# EAGLE design Reaccion-v0.9 (EAGLE 7.4.0)
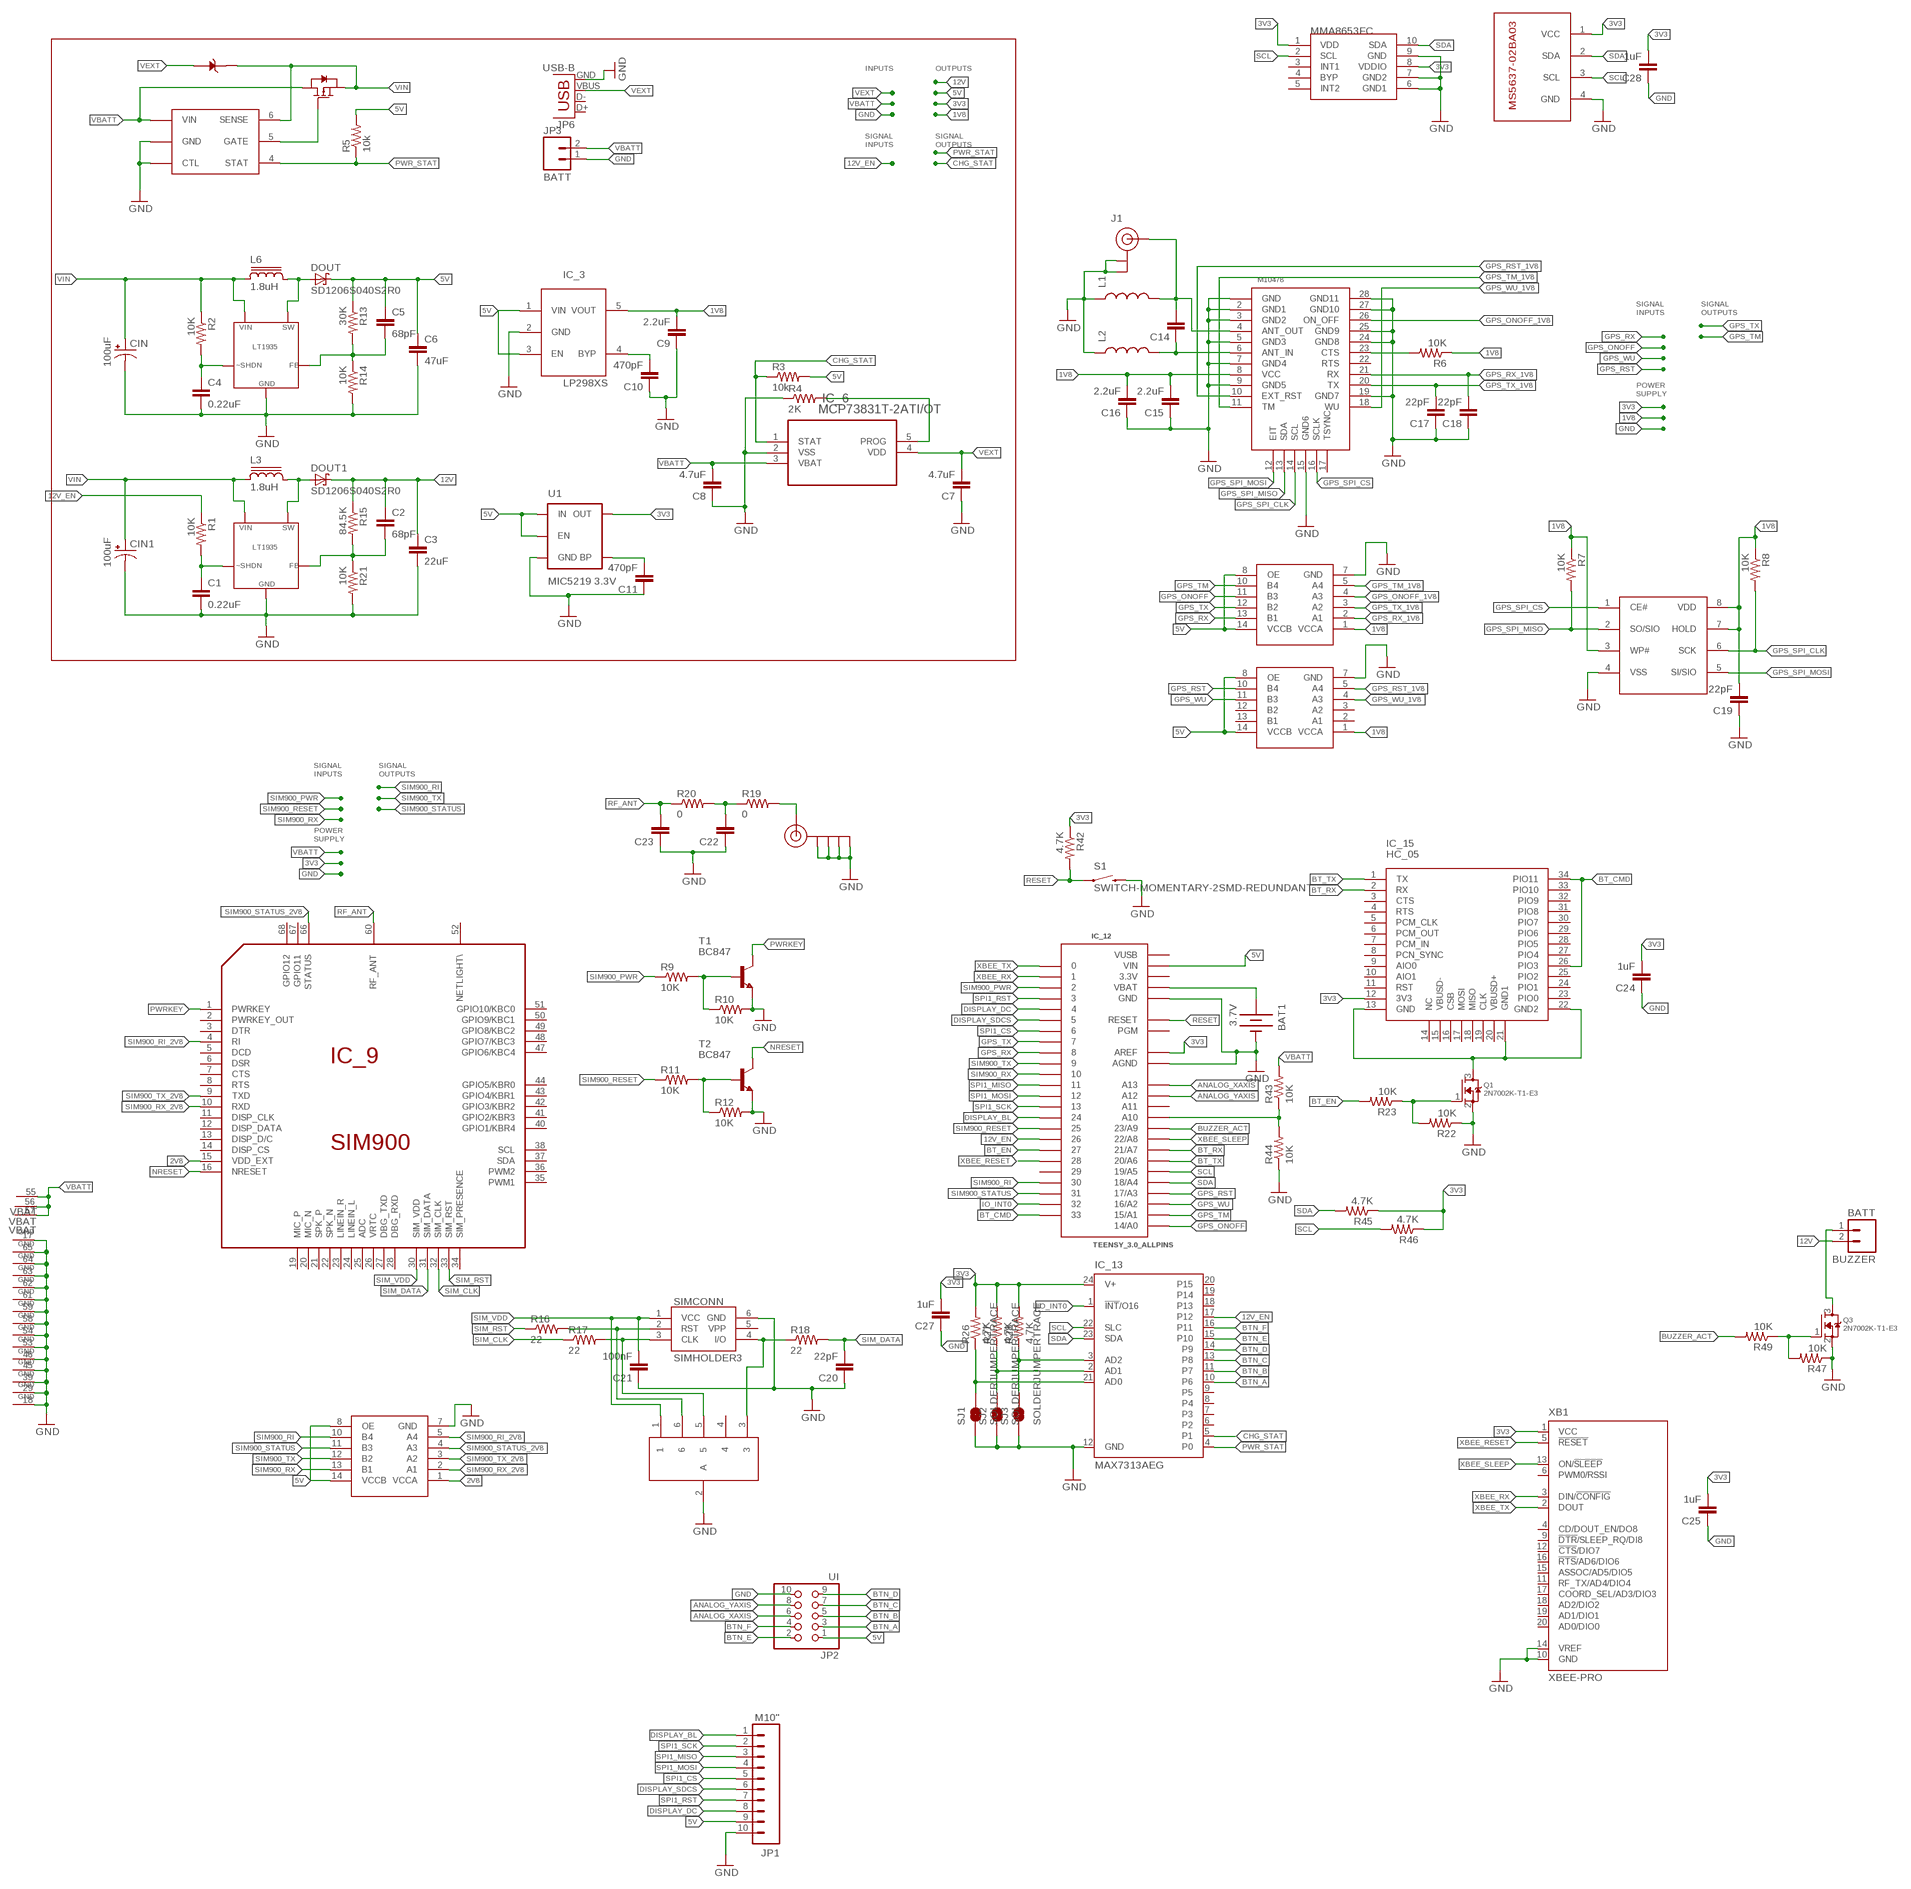
[diagram p0: schematic, sheet 1]

## Parts
BAT1  3.7V  BATTERY12MM  [BATTCON_12MM]
BUZZER  BATT  M02-JST-2-PTH-NO_SILK  [JST-2-PTH-NS]
C1  0.22uF  CAP0805  [0805]
C2  68pF  CAP0805  [0805]
C3  22uF  CAP0805  [0805]
C4  0.22uF  CAP0805  [0805]
C5  68pF  CAP0805  [0805]
C6  47uF  CAP0805  [0805]
C7  4.7uF  CAP0805  [0805]
C8  4.7uF  CAP0805  [0805]
C9  2.2uF  CAP0805  [0805]
C10  470pF  CAP0805  [0805]
C11  470pF  CAP0805  [0805]
C14  CAP0805  [0805]
C15  2.2uF  CAP0805  [0805]
C16  2.2uF  CAP0805  [0805]
C17  22pF  CAP0805  [0805]
C18  22pF  CAP0805  [0805]
C19  22pF  CAP0805  [0805]
C20  22pF  CAP0805  [0805]
C21  100nF  CAP0805  [0805]
C22  CAP0805  [0805]
C23  CAP0805  [0805]
C24  1uF  CAP0805  [0805]
C25  1uF  CAP0805  [0805]
C27  1uF  CAP0805  [0805]
C28  1uF  CAP0805  [0805]
CIN  100uF  TPSB107M010R0400  [1210-POLARIZED]
CIN1  100uF  TPSB107M010R0400  [1210-POLARIZED]
D4  1N5819HW-7-F  [SOD123]
DOUT  SD1206S040S2R0  [1206-POL]
DOUT1  SD1206S040S2R0  [1206-POL]
IC_1  LTC4412  [SOT23-6L]
IC_3  LP298XS  [SOT23-5L]
IC_6  MCP73831T-2ATI/OT  [SOT95P300X145-5N]
IC_7  MMA8653FC  [2X2-DFN]
IC_8  MS5637-02BA03  [MS5637-02BA03]
IC_9  SIM900  [SIM900]
IC_10  TXB0104  [SO14]
IC_11  SMF05C  [SOT665]
IC_12  TEENSY_3.0_ALLPINS  [TEENSY_3.0_ALLPINS]
IC_13  MAX7313AEG  [QSOP24]
IC_15  HC_05  [BLUETOOTH_SMD]
IC_16  M10478  [M10478]
IC_17  TXB0104  [SO14]
IC_18  TXB0104  [SO14]
IC_19  SST25WF040B  [SO08]
J1  U.FL  [U.FL]
J$1  SMA_EDGE  [SMA-EDGE]
JP1  M10"  [1X10]
JP2  UI  PINHD-2X5  [2X05]
JP3  BATT  M02-JST-2-PTH-NO_SILK  [JST-2-PTH-NS]
JP6  USB-B  USBPTH  [USB-B-PTH]
L1  INDUCTOR0805  [0805]
L2  INDUCTOR0805  [0805]
L3  1.8uH  SRR4028  [SRR4028]
L6  1.8uH  SRR4028  [SRR4028]
Q1  2N7002K-T1-E3  MOSFET-NREFLOW  [SOT23]
Q3  2N7002K-T1-E3  MOSFET-NREFLOW  [SOT23]
Q9  SI2301CDS  [SOT23]
R1  10K  RESISTOR0805-RES  [0805]
R2  10K  RESISTOR0805-RES  [0805]
R3  10k  RESISTOR0805-RES  [0805]
R4  2K  RESISTOR0805-RES  [0805]
R5  10k  RESISTOR0805-RES  [0805]
R6  10K  RESISTOR0805-RES  [0805]
R7  10K  RESISTOR0805-RES  [0805]
R8  10K  RESISTOR0805-RES  [0805]
R9  10K  RESISTOR0805-RES  [0805]
R10  10K  RESISTOR0805-RES  [0805]
R11  10K  RESISTOR0805-RES  [0805]
R12  10K  RESISTOR0805-RES  [0805]
R13  30K  RESISTOR0805-RES  [0805]
R14  10K  RESISTOR0805-RES  [0805]
R15  84.5K  RESISTOR0805-RES  [0805]
R16  22  RESISTOR0805-RES  [0805]
R17  22  RESISTOR0805-RES  [0805]
R18  22  RESISTOR0805-RES  [0805]
R19  0  RESISTOR0805-RES  [0805]
R20  0  RESISTOR0805-RES  [0805]
R21  10K  RESISTOR0805-RES  [0805]
R22  10K  RESISTOR0805-RES  [0805]
R23  10K  RESISTOR0805-RES  [0805]
R26  4.7K  RESISTOR0805-RES  [0805]
R27  4.7K  RESISTOR0805-RES  [0805]
R28  4.7K  RESISTOR0805-RES  [0805]
R42  4.7K  RESISTOR0805-RES  [0805]
R43  10K  RESISTOR0805-RES  [0805]
R44  10K  RESISTOR0805-RES  [0805]
R45  4.7K  RESISTOR0805-RES  [0805]
R46  4.7K  RESISTOR0805-RES  [0805]
R47  10K  RESISTOR0805-RES  [0805]
R49  10K  RESISTOR0805-RES  [0805]
S1  SWITCH-MOMENTARY-2SMD-REDUNDANT  [TACTILE-SWITCH-SMD]
SIMCONN  SIMHOLDER3  [SIMHOLDER3]
SJ1  SOLDERJUMPERTRACE  [SJ_2S-TRACE]
SJ2  SOLDERJUMPERTRACE  [SJ_2S-TRACE]
SJ3  SOLDERJUMPERTRACE  [SJ_2S-TRACE]
T1  BC847  [SOT23]
T2  BC847  [SOT23]
U1  MIC5219 3.3V  V_REG_MIC52193.3V  [SOT23-5]
U$1  LT1935ES5  [SOT23-5]
U$2  LT1935ES5  [SOT23-5]
XB1  XBEE-PRO  [XBEE-PRO]

## Nets
1V8: C9.2 C15.2 C16.2 C19.2 IC_3.5(VOUT) IC_16.8(VCC) IC_17.1(VCCA) IC_18.1(VCCA) IC_19.3(WP#) IC_19.7(HOLD) IC_19.8(VDD) R6.1 R7.1 R8.1
2V8: IC_9.15(VDD_EXT) IC_10.1(VCCA)
3V3: C24.2 C25.2 C27.2 C28.2 IC_7.1(VDD) IC_7.8(VDDIO) IC_8.1(VCC) IC_12.AREF IC_13.24(V+) IC_15.12(3V3) R26.2 R27.2 R28.2 R42.1 R45.1 R46.1 U1.5(OUT) XB1.1(VCC)
5V: C5.1 C6.1 DOUT.2(C) IC_3.1(VIN) IC_3.3(EN) IC_10.8(OE) IC_10.14(VCCB) IC_12.VIN IC_17.8(OE) IC_17.14(VCCB) IC_18.8(OE) IC_18.14(VCCB) JP1.9 JP2.1 R3.2 R5.2 R13.1 U1.1(IN) U1.3(EN)
12V: BUZZER.2 C2.1 C3.1 DOUT1.2(C) R15.1
12V_EN: IC_12.26 IC_13.17(P12) R1.1
ANALOG_XAXIS: IC_12.A13 JP2.6
ANALOG_YAXIS: IC_12.A12 JP2.8
BT_CMD: IC_12.33 IC_15.26(PIO3) IC_15.34(PIO11)
BT_EN: IC_12.27 R23.2
BT_RX: IC_12.21/A7 IC_15.2(RX)
BT_TX: IC_12.20/A6 IC_15.1(TX)
BTN_A: IC_13.10(P6) JP2.3
BTN_B: IC_13.11(P7) JP2.5
BTN_C: IC_13.13(P8) JP2.7
BTN_D: IC_13.14(P9) JP2.9
BTN_E: IC_13.15(P10) JP2.2
BTN_F: IC_13.16(P11) JP2.4
BUZZER_ACT: IC_12.23/A9 R49.2
CHG_STAT: IC_6.1(STAT) IC_13.5(P1) R3.1
DISPLAY_BL: IC_12.24 JP1.1
DISPLAY_DC: IC_12.4 JP1.8
DISPLAY_SDCS: IC_12.5 JP1.6
GND: BAT1.GND(-) C1.2 C3.2 C4.2 C6.2 C7.1 C8.1 C9.1 C10.1 C11.1 C15.1 C16.1 C17.1 C18.1 C19.1 C20.1 C21.1 C22.1 C23.1 C24.1 C25.1 C27.1 C28.1 CIN1.2(-) CIN.2(-) IC_1.2(GND) IC_1.3(CTL) IC_3.2(GND) IC_6.2(VSS) IC_7.6(GND1) IC_7.7(GND2) IC_7.9(GND) IC_8.4(GND) IC_9.17(GND) IC_9.18(GND) IC_9.29(GND) IC_9.39(GND) IC_9.45(GND) IC_9.46(GND) IC_9.53(GND) IC_9.54(GND) IC_9.58(GND) IC_9.59(GND) IC_9.61(GND) IC_9.62(GND) IC_9.63(GND) IC_9.64(GND) IC_9.65(GND) IC_10.7(GND) IC_11.2(A) IC_12.AGND IC_12.GND IC_12.GND1(GND) IC_12.GND2(GND) IC_13.12(GND) IC_16.1(GND) IC_16.2(GND1) IC_16.3(GND2) IC_16.5(GND3) IC_16.7(GND4) IC_16.9(GND5) IC_16.15(GND6) IC_16.19(GND7) IC_16.24(GND8) IC_16.25(GND9) IC_16.27(GND10) IC_16.28(GND11) IC_17.7(GND) IC_18.7(GND) IC_19.4(VSS) J1.P$1(GND) J1.P$2(GND) J$1.GND@0(GND) J$1.GND@1(GND) J$1.GND@2(GND) J$1.GND@3(GND) JP1.10 JP2.10 JP3.1 JP6.GND L1.1 L2.1 Q1.2(S) Q3.2(S) R4.1 R10.2 R12.2 R14.2 R21.2 R22.1 R44.1 R47.1 S1.3 S1.4 SIMCONN.6(GND) SJ1.1 SJ2.1 SJ3.1 T1.2(E) T2.2(E) U1.2(GND) U$1.2(GND) U$2.2(GND) XB1.10(GND) XB1.14(VREF)
GPS_ONOFF: IC_12.14/A0 IC_17.11(B3)
GPS_ONOFF_1V8: IC_16.26(ON_OFF) IC_17.4(A3)
GPS_RST: IC_12.17/A3 IC_18.10(B4)
GPS_RST_1V8: IC_16.10(EXT_RST) IC_18.5(A4)
GPS_RX: IC_12.8 IC_17.13(B1)
GPS_RX_1V8: C18.2 IC_16.21(RX) IC_17.2(A1)
GPS_SPI_CLK: IC_16.14(SCL) IC_19.6(SCK) R8.2
GPS_SPI_CS: IC_16.16(SCLK) IC_19.1(CE#)
GPS_SPI_MISO: IC_16.13(SDA) IC_19.2(SO/SIO) R7.2
GPS_SPI_MOSI: IC_16.12(EIT) IC_19.5(SI/SIO)
GPS_TM: IC_12.15/A1 IC_17.10(B4)
GPS_TM_1V8: IC_16.11(TM) IC_17.5(A4)
GPS_TX: IC_12.7 IC_17.12(B2)
GPS_TX_1V8: C17.2 IC_16.20(TX) IC_17.3(A2)
GPS_WU: IC_12.16/A2 IC_18.11(B3)
GPS_WU_1V8: IC_16.18(WU) IC_18.4(A3)
IO_INT0: IC_12.32 IC_13.1(!INT!/O16)
N$1: DOUT1.1(A) L3.2 U$2.1(SW)
N$2: DOUT.1(A) L6.2 U$1.1(SW)
N$3: C1.1 R1.2 U$2.4(SHDN)
N$4: C11.2 U1.4(BP)
N$5: C2.2 R15.2 R21.1 U$2.3(FB)
N$6: C5.2 R13.2 R14.1 U$1.3(FB)
N$8: C4.1 R2.2 U$1.4(SHDN)
N$11: IC_6.5(PROG) R4.2
N$12: IC_1.5(GATE) Q9.1(GATE)
N$13: C10.2 IC_3.4(BYP)
N$15: C14.1 IC_16.6(ANT_IN) L2.2
N$18: C14.2 IC_16.4(ANT_OUT) J1.P$3(SIGNAL) L1.2
N$19: BUZZER.1 Q3.3(D)
N$20: IC_16.23(CTS) R6.2
N$21: R9.2 R10.1 T1.1(B)
N$22: R11.2 R12.1 T2.1(B)
N$25: IC_15.13(GND) IC_15.21(GND1) IC_15.22(GND2) Q1.3(D)
N$27: IC_11.3 R18.1 SIMCONN.4(I/O)
N$28: C22.2 R19.1 R20.2
N$29: IC_11.6 R16.2 SIMCONN.2(RST)
N$30: IC_11.5 R17.2 SIMCONN.3(CLK)
N$31: J$1.SIG(SIGNAL) R19.2
N$34: Q1.1(G) R22.2 R23.1
N$35: Q3.1(G) R47.2 R49.1
N$37: IC_13.21(AD0) R26.1 SJ1.2
N$38: IC_13.3(AD2) R28.1 SJ3.2
N$39: IC_13.2(AD1) R27.1 SJ2.2
N$43: BAT1.PWR@1(+) IC_12.VBAT
N$44: IC_12.A10 R43.1 R44.2
NRESET: IC_9.16(NRESET) T2.3(C)
PWR_STAT: IC_1.4(STAT) IC_13.4(P0) R5.1
PWRKEY: IC_9.1(PWRKEY) T1.3(C)
RESET: IC_12.RESET R42.2 S1.1 S1.2
RF_ANT: C23.2 IC_9.60(RF_ANT) R20.1
SCL: IC_7.2(SCL) IC_8.3(SCL) IC_12.19/A5 IC_13.22(SLC) R46.2
SDA: IC_7.10(SDA) IC_8.2(SDA) IC_12.18/A4 IC_13.23(SDA) R45.2
SIM900_PWR: IC_12.2 R9.1
SIM900_RESET: IC_12.25 R11.1
SIM900_RI: IC_10.10(B4) IC_12.30
SIM900_RI_2V8: IC_9.4(RI) IC_10.5(A4)
SIM900_RX: IC_10.13(B1) IC_12.10
SIM900_RX_2V8: IC_9.10(RXD) IC_10.2(A1)
SIM900_STATUS: IC_10.11(B3) IC_12.31
SIM900_STATUS_2V8: IC_9.66(STATUS) IC_10.4(A3)
SIM900_TX: IC_10.12(B2) IC_12.9
SIM900_TX_2V8: IC_9.9(TXD) IC_10.3(A2)
SIM_CLK: IC_9.32(SIM_CLK) R17.1
SIM_DATA: C20.2 IC_9.31(SIM_DATA) R18.2
SIM_RST: IC_9.33(SIM_RST) R16.1
SIM_VDD: C21.2 IC_9.30(SIM_VDD) IC_11.1 SIMCONN.1(VCC)
SPI1_CS: IC_12.6 JP1.5
SPI1_MISO: IC_12.11 JP1.3
SPI1_MOSI: IC_12.12 JP1.4
SPI1_RST: IC_12.3 JP1.7
SPI1_SCK: IC_12.13 JP1.2
VBATT: C8.2 IC_1.1(VIN) IC_6.3(VBAT) IC_9.55(VBAT) IC_9.56(VBAT) IC_9.57(VBAT) JP3.2 Q9.3(DRAIN) R43.2
VEXT: C7.2 D4.2(ANODE) IC_6.4(VDD) JP6.VBUS
VIN: CIN1.1(+) CIN.1(+) D4.1(CATHODE) IC_1.6(SENSE) L3.1 L6.1 Q9.2(SOURCE) R2.1 U$1.5(VIN) U$2.5(VIN)
XBEE_RESET: IC_12.28 XB1.5(!RESET)
XBEE_RX: IC_12.1 XB1.3(DIN/!CONFIG)
XBEE_SLEEP: IC_12.22/A8 XB1.13(ON/!SLEEP)
XBEE_TX: IC_12.0 XB1.2(DOUT)
Unconnected: IC_7.3(INT1) IC_7.4(BYP) IC_7.5(INT2) IC_9.2(PWRKEY_OUT) IC_9.3(DTR) IC_9.5(DCD) IC_9.6(DSR) IC_9.7(CTS) IC_9.8(RTS) IC_9.11(DISP_CLK) IC_9.12(DISP_DATA) IC_9.13(DISP_D/C) IC_9.14(DISP_CS) IC_9.19(MIC_P) IC_9.20(MIC_N) IC_9.21(SPK_P) IC_9.22(SPK_N) IC_9.23(LINEIN_R) IC_9.24(LINEIN_L) IC_9.25(ADC) IC_9.26(VRTC) IC_9.27(DBG_TXD) IC_9.28(DBG_RXD) IC_9.34(SIM_PRESENCE) IC_9.35(PWM1) IC_9.36(PWM2) IC_9.37(SDA) IC_9.38(SCL) IC_9.40(GPIO1/KBR4) IC_9.41(GPIO2/KBR3) IC_9.42(GPIO3/KBR2) IC_9.43(GPIO4/KBR1) IC_9.44(GPIO5/KBR0) IC_9.47(GPIO6/KBC4) IC_9.48(GPIO7/KBC3) IC_9.49(GPIO8/KBC2) IC_9.50(GPIO9/KBC1) IC_9.51(GPIO10/KBC0) IC_9.52(NETLIGHT\) IC_9.67(GPIO11) IC_9.68(GPIO12) IC_11.4 IC_12.29 IC_12.A11 IC_12.PGM IC_13.6(P2) IC_13.7(P3) IC_13.8(P4) IC_13.9(P5) IC_13.18(P13) IC_13.19(P14) IC_13.20(P15) IC_15.3(CTS) IC_15.4(RTS) IC_15.5(PCM_CLK) IC_15.6(PCM_OUT) IC_15.7(PCM_IN) IC_15.8(PCN_SYNC) IC_15.9(AIO0) IC_15.10(AIO1) IC_15.11(RST) IC_15.14(NC) IC_15.15(VBUSD-) IC_15.16(CSB) IC_15.17(MOSI) IC_15.18(MISO) IC_15.19(CLK) IC_15.20(VBUSD+) IC_15.23(PIO0) IC_15.24(PIO1) IC_15.25(PIO2) IC_15.27(PIO4) IC_15.28(PIO5) IC_15.29(PIO6) IC_15.30(PIO7) IC_15.31(PIO8) IC_15.32(PIO9) IC_15.33(PIO10) IC_16.17(TSYNC) IC_16.22(RTS) IC_18.2(A1) IC_18.3(A2) IC_18.12(B2) IC_18.13(B1) JP6.D+ JP6.D- SIMCONN.5(VPP) XB1.4(CD/DOUT_EN/DO8) XB1.6(PWM0/RSSI) XB1.9(!DTR!/SLEEP_RQ/DI8) XB1.11(RF_TX/AD4/DIO4) XB1.12(!CTS!/DIO7) XB1.15(ASSOC/AD5/DIO5) XB1.16(!RTS!/AD6/DIO6) XB1.17(COORD_SEL/AD3/DIO3) XB1.18(AD2/DIO2) XB1.19(AD1/DIO1) XB1.20(AD0/DIO0)

## Notes on the sheet
- INPUTS | OUTPUTS
- SIGNAL
  INPUTS
- SIGNAL
  OUTPUTS
- SIGNAL
  INPUTS
- SIGNAL
  OUTPUTS
- POWER
  SUPPLY
- SIGNAL
  INPUTS
- SIGNAL
  OUTPUTS
- POWER
  SUPPLY

## Power pins joined to a net without a drawn wire
3.3V: IC_12.3.3V IC_12.3.3V1(3.3V) IC_12.3.3V2(3.3V)
VUSB: IC_12.VUSB

## Library data of the parts
BAT1 = SparkFun-Electromechanical:BATTERY: Battery Holders Various common sizes : AA, AAA, 18650 (PRT-12895), 20mm coin cell and 12mm coin cell. 20MM_4LEGS, BATT-10373; PROD_ID: BATT-08044
BUZZER JP3 = SparkFun-Connectors:M02: Standard 2-pin 0.1" header. Use with - straight break away headers ( PRT-00116) - right angle break away headers (PRT-00553) - swiss pins (PRT-00743) - machine pins (PRT-00117) - female headers (PRT-00115) Molex polarized connector foot print use with: PRT-08233 with associated crimp pins and housings. 2.54_SCREWTERM for use with PRT-10571. 3.5mm Screw Terminal footprints for PRT-08084 5mm Screw Terminal footprints for use with PRT-08432
C1-C11 C14-C25 C27 C28 = SparkFun-Capacitors:CAP: Capacitor Standard 0603 ceramic capacitor, and 0.1" leaded capacitor.
CIN CIN1 = custom_componentsv0.9:TPSB107M010R0400
D4 = custom_components:1N5819HW-7-F
DOUT DOUT1 = custom_componentsv0.9:SD1206S040S2R0
IC_1 = custom_components:LTC4412
IC_3 = adafruit:LP298X
IC_6 = custom_components:MCP73831T-2ATI/OT: IC, BATT CHARGER, Li-Ion Li-Polymer, 500 mA; MPN: MCP73831T-2ATI/OT; OC_FARNELL: 1834890; OC_NEWARK: 84R5196; PACKAGE: SOT23-5; SUPPLIER: Microchip
IC_7 = Reaccion-Custom-revised:MMA8653FC
IC_8 = Reaccion-Custom:MS5637-02BA03
IC_9 = sim900:SIM900
IC_10 IC_17 IC_18 = custom-components:TXB0104
IC_11 = custom-components:SMF05C
IC_12 = Teensy3.0:TEENSY_3.0_ALLPINS: Teensy 3.0 with all pin holes and optional SMD-mount unshrouded header on bottom of Teensy 3.0. For more basic versions, see 'Basic', '+4' and 'AllAnalogPins'. Requires the installation of a un-shrouded SMD header on the underside of the Teensy 3.0
IC_13 = maxim:MAX7313AEG: 16-Port I/O Expander with LED Intensity Control, Interrupt, and Hot-Insertion Protection Source: http://datasheets.maxim-ic.com/en/ds/MAX7313.pdf; MPN: MAX7313AEG+; OC_FARNELL: unknown; OC_NEWARK: 53K7268
IC_15 = Bluetooth HC-05:HC_05: HC-05 Bluetooth Module
IC_16 = custom-components:M10478
IC_19 = custom-components:SST25WF040B
J1 = SparkFun-Connectors:U.FL: SMD antenna connector- WRL-09144
J$1 = SparkFun-Connectors:SMA_EDGE: SMA Antenna Connector End launch SMA connector. The paste layer has been removed so that the connector can be hand soldered onto the board after reflow.
JP1 = SparkFun-Connectors:M10: Header 10 Standard 10-pin 0.1" header. Use with straight break away headers (SKU : PRT-00116), right angle break away headers (PRT-00553), swiss pins (PRT-00743), machine pins (PRT-00117), and female headers (PRT-00115).
JP2 = pinhead:PINHD-2X5: PIN HEADER
JP6 = SparkFun-Connectors:USB: USB Connectors USB-B-PTH is fully proven SKU : PRT-00139/CONN-08278 USB-miniB is fully proven SKU : PRT-00587 USB-A-PCB is untested. USB-A-H is throughly reviewed, but untested. Spark Fun Electronics SKU : PRT-00437 USB-B-SMT is throughly reviewed, but untested. Needs silkscreen touching up. USB-A-S has not been used/tested USB-MB-H has not been used/tested USB-MICROB has been used. CONN-09505; PROD_ID: CONN-08278
L1 L2 = SparkFun-Passives:INDUCTOR: Inductors Basic Inductor/Choke - 0603 and 1206. Footprints are not proven and vary greatly between part numbers. SRN6045- 33uH, 20% 1.4A SDR0403-560KL - 56uH, 10%, 500mA RMS/740mA peak
L3 L6 = inductor-bourns:SRR4028: POWER INDUCTOR
Q1 Q3 = adafruit:MOSFET-N: N-Channel Mosfet 2N7002E - 60V 260mA SOT23 [Digikey: 2N7002ET1GOSTR-ND] - REEL BSH103 - 30V 850mA SOT23 [Digikey: 568-5013-1-ND]
Q9 = custom_components:SI2301CDS
R1-R23 R26-R28 R42-R47 R49 = SparkFun-Resistors:RESISTOR: Resistor Basic schematic elements and footprints for 0603, 1206, and PTH resistors.
S1 = SparkFun-Electromechanical:SWITCH-MOMENTARY-2: Various NO switches- pushbuttons, reed, etc; PROD_ID: SWCH-08247
SIMCONN = SparkFun-Connectors:SIMHOLDER3: Alternate SIM card socket
SJ1-SJ3 = SparkFun-Retired:SOLDERJUMPER: Solder Jumper Standard SMD solder jumper. Used to automate production. Two varients : Normally Open and Normally Closed are the same, but have different paste layers. NC will have a large amount of paste and should jumper during reflow.
T1 T2 = transistor:BC847: NPN TRANSISTOR
U1 = SparkFun-PowerIC:V_REG_MIC5219: V_REG MIC5219 Standard 3.3V and 5V 500mA LDO voltage regulator in SOT-23 layout. Micrel part MIC5219. BP (by-pass) pin is used to lower output noise with 470pF cap, may be left open.; PROD_ID: VREG-09872
U$1 U$2 = custom_componentsv0.9:LT1935ES5
XB1 = maxstream:XBEE: XBee (TM) /XBee-PRO(TM) OEM RF Modules Source: MaxStream, Inc. xbee_productmanual.pdf; MPN: XBP24-AWI-001; OC_FARNELL: 1337916; OC_NEWARK: 42M2667

## Net classes
0 default: clearance 0.205 mm

## Board
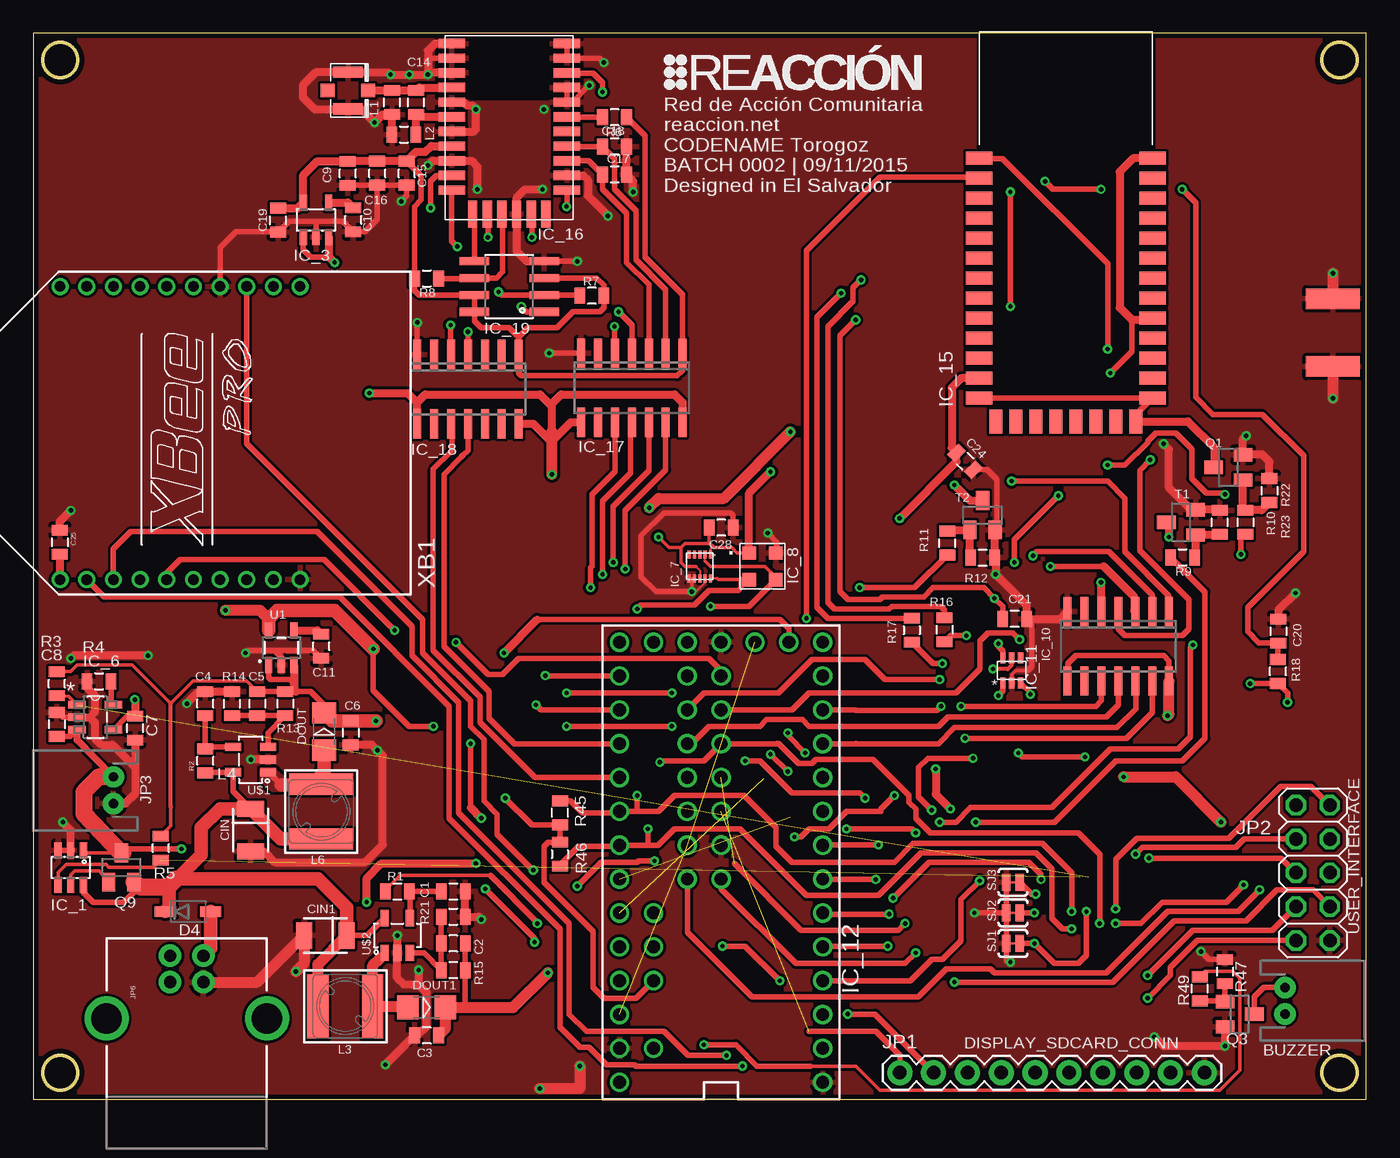
[diagram p1: board, top side]
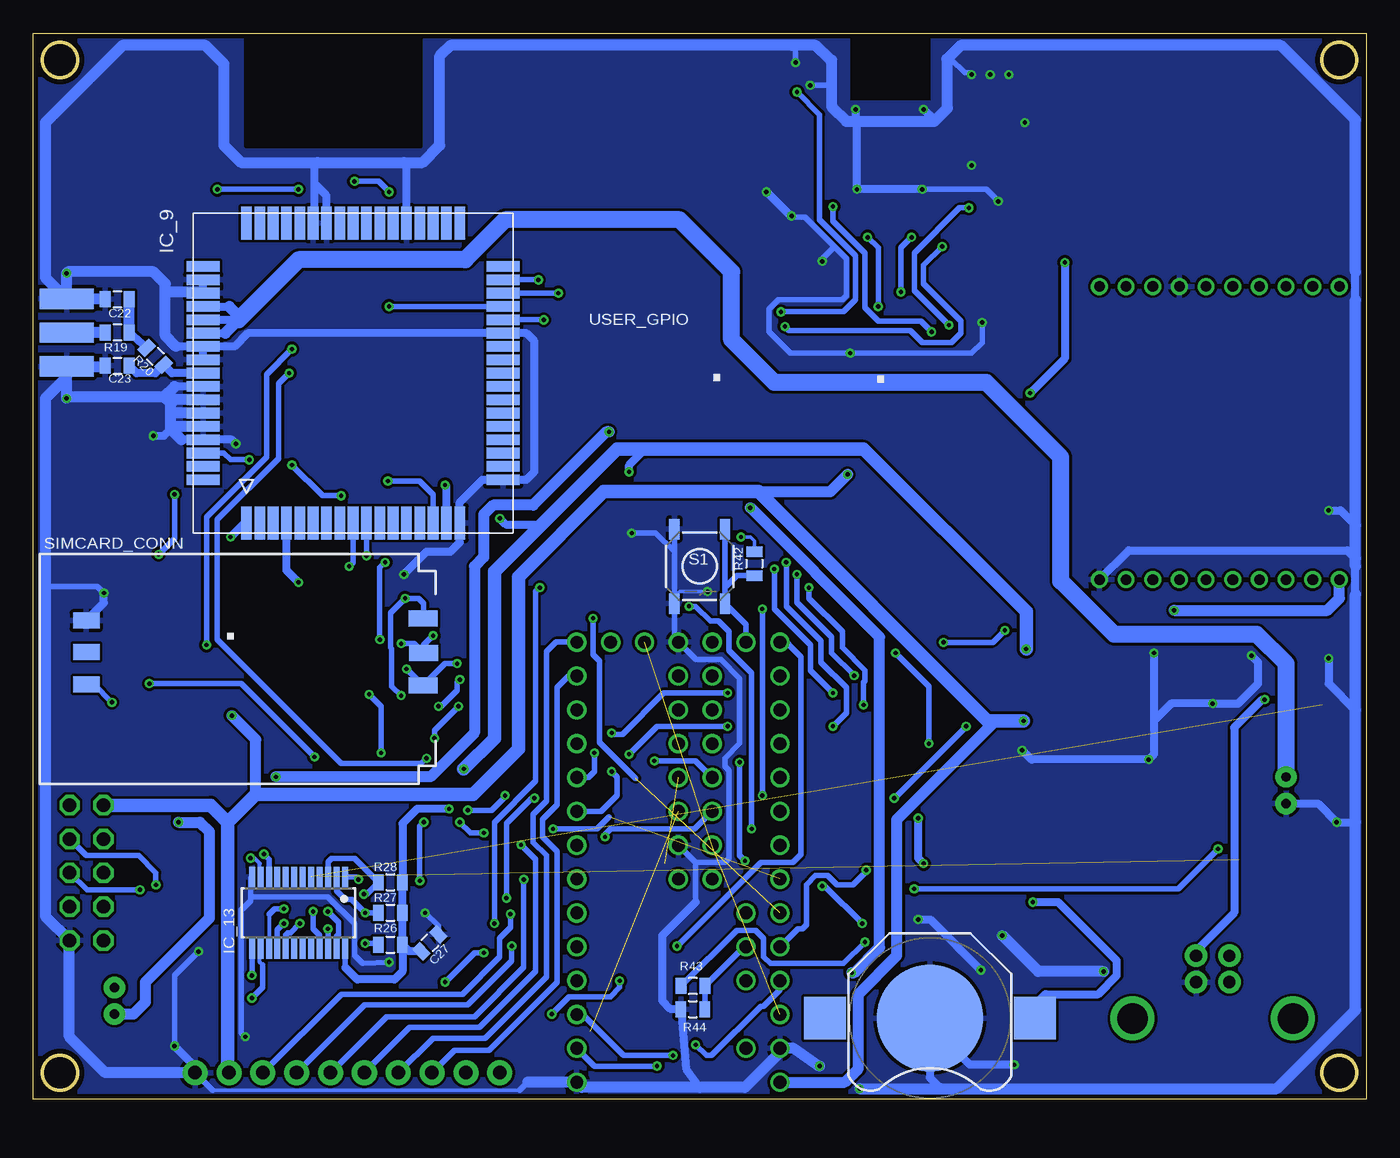
[diagram p2: board, bottom side, seen from below]

Size 100 x 80 mm. Coordinates in mm from the lower left corner, seen from the top.
Outline: 0,0 100,0 100,80 0,80 0,0
Outline: circle at 2,78 radius 1.3
Outline: circle at 98,78 radius 1.3
Outline: circle at 98,2 radius 1.3
Outline: circle at 2,2 radius 1.3
Copper layers (1*16): Top 0.0356mm / dielectric 1.5011mm / Bottom 0.0356mm
Design rules "LaenPCBOrder": minimum track width 6mil, minimum drill 13mil, track to track 6mil, track to pad 6mil, pad to pad 6mil, via to via 6mil, smd to smd 6mil, copper to edge 15mil, drill to drill 6mil, minimum pad ring 7mil, minimum via ring 7mil, stop-mask expansion 3mil, vias tented up to drill 0mil, thermal gap 10mil
tRestrict: area 71,71.6 to 84,80
bRestrict: area 71,71.5 to 84,80

### Footprints (pad centres in the part's own frame; a part is rotated, then mirrored left to right if it is on the bottom)
BATTCON_12MM = smd 8 x 8: GND 0,0 | smd 3.175 x 3.175: PWR@1 -7.874,0; PWR@2 7.874,0
JST-2-PTH-NS = drill 0.7 pad 1.6: 1 -1,0; 2 1,0
0805 = smd 0.8 x 1.2: 1 -0.9,0; 2 0.9,0
1210-POLARIZED = smd 1.2 x 2: 1 -1.6,0; 2 1.6,0
SOD123 = smd 1.6 x 0.8: 1 -1.7,0; 2 1.7,0
1206-POL = smd 1.6 x 1.8: 1 -1.4,0; 2 1.4,0
SOT23-6L = smd 0.55 x 1.2: 1 -0.95,-1.3; 2 0,-1.3; 3 0.95,-1.3; 4 0.95,1.3; 5 0,1.3; 6 -0.95,1.3
SOT23-5L = smd 0.55 x 1.2: 1 -0.95,-1.3; 2 0,-1.3; 3 0.95,-1.3; 4 0.95,1.3; 5 -0.95,1.3
SOT95P300X145-5N = smd 1.321 x 0.559: 1 -1.372,0.94; 2 -1.372,0; 3 -1.372,-0.94; 4 1.372,-0.94; 5 1.372,0.94
2X2-DFN = smd 0.6 x 0.225: 1 -0.897,0.8; 2 -0.897,0.4; 3 -0.897,0; 4 -0.897,-0.4; 5 -0.897,-0.8; 6 0.897,-0.8; 7 0.897,-0.4; 8 0.897,0; 9 0.897,0.4; 10 0.897,0.8
MS5637-02BA03 = smd 1 x 1: 1 -1,1; 2 -1,-1; 3 1,-1; 4 1,1
SIM900 = smd 2.5 x 0.8: 1 -11.25,8; 2 -11.25,7; 3 -11.25,6; 4 -11.25,5; 5 -11.25,4; 6 -11.25,3; 7 -11.25,2; 8 -11.25,1; 9 -11.25,0; 10 -11.25,-1; 11 -11.25,-2; 12 -11.25,-3; 13 -11.25,-4; 14 -11.25,-5; 15 -11.25,-6; 16 -11.25,-7; 17 -11.25,-8; 35 11.25,-8; 36 11.25,-7; 37 11.25,-6; 38 11.25,-5; 39 11.25,-4; 40 11.25,-3; 41 11.25,-2; 42 11.25,-1; 43 11.25,0; 44 11.25,1; 45 11.25,2; 46 11.25,3; 47 11.25,4; 48 11.25,5; 49 11.25,6; 50 11.25,7; 51 11.25,8 | smd 0.8 x 2.5: 18 -8,-11.25; 19 -7,-11.25; 20 -6,-11.25; 21 -5,-11.25; 22 -4,-11.25; 23 -3,-11.25; 24 -2,-11.25; 25 -1,-11.25; 26 0,-11.25; 27 1,-11.25; 28 2,-11.25; 29 3,-11.25; 30 4,-11.25; 31 5,-11.25; 32 6,-11.25; 33 7,-11.25; 34 8,-11.25; 52 8,11.25; 53 7,11.25; 54 6,11.25; 55 5,11.25; 56 4,11.25; 57 3,11.25; 58 2,11.25; 59 1,11.25; 60 0,11.25; 61 -1,11.25; 62 -2,11.25; 63 -3,11.25; 64 -4,11.25; 65 -5,11.25; 66 -6,11.25; 67 -7,11.25; 68 -8,11.25
SO14 = smd 0.6 x 2.2: 1 -3.81,-2.6; 2 -2.54,-2.6; 3 -1.27,-2.6; 4 0,-2.6; 5 1.27,-2.6; 6 2.54,-2.6; 7 3.81,-2.6; 8 3.81,2.6; 9 2.54,2.6; 10 1.27,2.6; 11 0,2.6; 12 -1.27,2.6; 13 -2.54,2.6; 14 -3.81,2.6
SOT665 = smd 0.406 x 0.838: 1 -0.66,-0.927; 2 0,-0.927; 3 0.66,-0.927; 4 0.66,0.927; 5 0,0.927; 6 -0.66,0.927
TEENSY_3.0_ALLPINS = drill 0.965: 0 -7.62,13.97; 1 -7.62,11.43; 2 -7.62,8.89; 3 -7.62,6.35; 3.3V 7.62,11.43; 3.3V1 -2.54,-16.51; 3.3V2 2.54,-1.27; 4 -7.62,3.81; 5 -7.62,1.27; 6 -7.62,-1.27; 7 -7.62,-3.81; 8 -7.62,-6.35; 9 -7.62,-8.89; 10 -7.62,-11.43; 11 -7.62,-13.97; 12 -7.62,-16.51; 13 7.62,-16.51; 14/A0 7.62,-13.97; 15/A1 7.62,-11.43; 16/A2 7.62,-8.89; 17/A3 7.62,-6.35; 18/A4 7.62,-3.81; 19/A5 7.62,-1.27; 20/A6 7.62,1.27; 21/A7 7.62,3.81; 22/A8 7.62,6.35; 23/A9 7.62,8.89; 24 0,-3.81; 25 0,-6.35; 26 0,-8.89; 27 0,-11.43; 28 0,-13.97; 29 2.54,-13.97; 30 2.54,-11.43; 31 2.54,-8.89; 32 2.54,-6.35; 33 2.54,-3.81; A10 5.08,6.35; A11 5.08,3.81; A12 0,1.27; A13 2.54,1.27; AGND 7.62,13.97; AREF 5.08,8.89; GND -7.62,16.51; GND1 0,-16.51; GND2 0,-1.27; PGM 2.54,-16.51; RESET 5.08,-16.51; VBAT -5.08,-16.51; VIN 7.62,16.51; VUSB 5.08,13.97
QSOP24 = smd 0.45 x 1.5: 1 -3.493,-2.69; 2 -2.857,-2.69; 3 -2.223,-2.69; 4 -1.587,-2.69; 5 -0.953,-2.69; 6 -0.318,-2.69; 7 0.318,-2.69; 8 0.953,-2.69; 9 1.587,-2.69; 10 2.223,-2.69; 11 2.857,-2.69; 12 3.493,-2.69; 13 3.493,2.69; 14 2.857,2.69; 15 2.223,2.69; 16 1.587,2.69; 17 0.953,2.69; 18 0.318,2.69; 19 -0.318,2.69; 20 -0.953,2.69; 21 -1.587,2.69; 22 -2.223,2.69; 23 -2.857,2.69; 24 -3.493,2.69
BLUETOOTH_SMD = smd 2 x 1: 1 -6.35,3.81; 2 -6.35,2.31; 3 -6.35,0.81; 4 -6.35,-0.69; 5 -6.35,-2.19; 6 -6.35,-3.69; 7 -6.35,-5.19; 8 -6.35,-6.69; 9 -6.35,-8.19; 10 -6.35,-9.69; 11 -6.35,-11.19; 12 -6.35,-12.69; 13 -6.35,-14.19; 22 6.65,-14.19; 23 6.65,-12.69; 24 6.65,-11.19; 25 6.65,-9.69; 26 6.65,-8.19; 27 6.65,-6.69; 28 6.65,-5.19; 29 6.65,-3.69; 30 6.65,-2.19; 31 6.65,-0.69; 32 6.65,0.81; 33 6.65,2.31; 34 6.65,3.81 | smd 1 x 1.8: 14 -5.1,-15.94; 15 -3.6,-15.94; 16 -2.1,-15.94; 17 -0.6,-15.94; 18 0.9,-15.94; 19 2.4,-15.94; 20 3.9,-15.94; 21 5.4,-15.94
M10478 = smd 2 x 0.7: 1 -4.32,1.835; 2 -4.32,0.735; 3 -4.32,-0.365; 4 -4.32,-1.465; 5 -4.32,-2.565; 6 -4.32,-3.665; 7 -4.32,-4.765; 8 -4.32,-5.865; 9 -4.32,-6.965; 10 -4.32,-8.065; 11 -4.32,-9.165; 18 4.32,-9.165; 19 4.32,-8.065; 20 4.32,-6.965; 21 4.32,-5.865; 22 4.32,-4.765; 23 4.32,-3.665; 24 4.32,-2.565; 25 4.32,-1.465; 26 4.32,-0.365; 27 4.32,0.735; 28 4.32,1.835 | smd 0.7 x 2: 12 -2.75,-10.965; 13 -1.65,-10.965; 14 -0.55,-10.965; 15 0.55,-10.965; 16 1.65,-10.965; 17 2.75,-10.965
SO08 = smd 0.61 x 2.21: 1 -1.905,-2.616; 2 -0.635,-2.616; 3 0.635,-2.616; 4 1.905,-2.616; 5 1.905,2.616; 6 0.635,2.616; 7 -0.635,2.616; 8 -1.905,2.616
U.FL = smd 2.2 x 0.85: P$1 0,1.375; P$2 0,-1.375 | smd 1.05 x 1: P$3 1.525,0; P$4 -1.525,0
SMA-EDGE = smd 1.524 x 4.064: GND@0 0,0; GND@1 5.08,0; SIG 2.54,0 | smd 1.524 x 4.064 bottom: GND@2 0,0; GND@3 5.08,0
1X10 = drill 1.016 pad 1.88: 1 0,0; 2 2.54,0; 3 5.08,0; 4 7.62,0; 5 10.16,0; 6 12.7,0; 7 15.24,0; 8 17.78,0; 9 20.32,0; 10 22.86,0
2X05 = drill 1.016 octagon: 1 -5.08,-1.27; 2 -5.08,1.27; 3 -2.54,-1.27; 4 -2.54,1.27; 5 0,-1.27; 6 0,1.27; 7 2.54,-1.27; 8 2.54,1.27; 9 5.08,-1.27; 10 5.08,1.27
USB-B-PTH = drill 0.914 pad 1.676: D+ 0,1.25; D- 1.981,1.25; GND 0,-1.25; VBUS 1.981,-1.25 | drill 2.286: S1 -2.718,-6.02; S2 -2.718,6.02
SRR4028 = smd 4.8 x 1.6: 1 0,2.05; 2 0,-2.05
SOT23 = smd 1 x 1.4: 1 -0.95,-1.1; 2 0.95,-1.1; 3 0,1.1
TACTILE-SWITCH-SMD = smd 1.524 x 0.762: 1 -2.794,1.905; 2 2.794,1.905; 3 -2.794,-1.905; 4 2.794,-1.905
SIMHOLDER3 = smd 2.2 x 1.2: 1 0.95,4.81; 2 0.91,7.41; 3 0.95,9.86 | smd 2 x 1.2: 4 26.2,9.78; 5 26.22,7.34; 6 26.22,4.98
SJ_2S-TRACE = smd 0.635 x 1.27: 1 -0.508,0; 2 0.508,0
SOT23-5 = smd 0.55 x 1.2: 1 -0.95,-1.3; 2 0,-1.3; 3 0.95,-1.3; 4 0.95,1.3; 5 -0.95,1.3
SOT23-5' = smd 0.62 x 1.22: 1 -0.95,-1.31; 2 0,-1.31; 3 0.95,-1.31; 4 0.95,1.31; 5 -0.95,1.31
XBEE-PRO = drill 0.8 pad 1.27: 1 -11,9; 2 -11,7; 3 -11,5; 4 -11,3; 5 -11,1; 6 -11,-1; 7 -11,-3; 8 -11,-5; 9 -11,-7; 10 -11,-9; 11 11,-9; 12 11,-7; 13 11,-5; 14 11,-3; 15 11,-1; 16 11,1; 17 11,3; 18 11,5; 19 11,7; 20 11,9

### Placement (x,y rotation side)
BAT1  32.72,6.1 180 bottom
BUZZER  93.9,7.4 270 top
C1  31.5,15.6 0 top
C2  31.5,11.7 180 top
C3  29.5,4.8 180 top
C4  12.9,29.7 90 top
C5  16.8,29.7 270 top
C6  23.8,27.5 270 top
C7  7.63,27.87 90 top
C8  1.75,28.14 270 top
C9  23.58,69.49 90 top
C10  24,66 90 top
C11  21.6,34 90 top
C14  28.7,74.8 90 top
C15  28,69.5 90 top
C16  25.8,69.5 90 top
C17  43.6,69.4 180 top
C18  43.6,71.5 180 top
C19  18.35,65.98 90 top
C20  93.42,35.14 270 top
C21  73.63,36.06 180 top
C22  93.7,60.05 0 bottom
C23  93.7,55.05 0 bottom
C24  69.9,47.88 135 top
C25  1.97,41.81 270 top
C27  70.24,11.75 225 bottom
C28  51.6,42.9 180 top
CIN  16.3,20.2 270 top
CIN1  21.9,12.3 180 top
D4  11.6,14.1 0 top
DOUT  21.8,27.6 90 top
DOUT1  29.5,6.9 0 top
IC_1  2.8,17.4 180 top
IC_3  21.2,66 0 top
IC_6  4.64,28.68 0 top
IC_7  50,40 270 top
IC_8  54.7,40 0 top
IC_9  76,54.5 90 bottom
IC_10  81.4,34 180 top
IC_11  73.4,32.19 0 top
IC_12  51.6,17.8 180 top
IC_13  80.1,14 180 bottom
IC_15  77.32,66.82 0 top
IC_16  35.7,77.4 0 top
IC_17  44.9,53.4 180 top
IC_18  32.6,53.3 180 top
IC_19  35.7,61 90 top
J1  23.6,75.7 0 top
J$1  97.5,55 90 bottom
JP1  65,2 0 top
JP2  96,17 270 top
JP3  6,23.2 90 top
JP6  11.5,8.8 90 top
L1  26.9,74.8 90 top
L2  27.8,72.4 0 top
L3  23.4,7 90 top
L6  21.6,21.6 180 top
Q1  89.66,47.43 90 top
Q3  90.5,6.4 270 top
Q9  6.6,17.4 0 top
R1  27.3,15.6 0 top
R2  12.9,25.4 90 top
R3  1.75,31.2 90 top
R4  4.92,31.37 0 top
R5  9.55,18.85 90 top
R6  43.6,73.7 180 top
R7  41.9,60.3 180 top
R8  29.5,61.6 0 top
R9  86.23,40.67 0 top
R10  89,43.3 90 top
R11  68.56,41.75 90 top
R12  71.22,40.66 0 top
R13  18.9,29.7 270 top
R14  14.9,29.7 90 top
R15  31.5,9.7 180 top
R16  68.36,35.24 270 top
R17  65.9,35.2 270 top
R18  93.37,32.11 90 top
R19  93.7,57.55 180 bottom
R20  90.85,55.76 135 bottom
R21  31.5,13.7 0 top
R22  92.74,45.68 270 top
R23  90.93,43.31 270 top
R26  73.2,11.6 0 bottom
R27  73.2,14 0 bottom
R28  73.2,16.3 0 bottom
R42  45.9,40.2 270 bottom
R43  50.5,8.51 180 bottom
R44  50.51,6.77 0 bottom
R45  39.5,21.5 90 top
R46  39.5,18.4 270 top
R47  89.4,9.6 270 top
R49  87.5,8.3 90 top
S1  50,40 270 bottom
SIMCONN  69.8,40.91 180 bottom
SJ1  73.5,11.7 0 top
SJ2  73.5,14 0 top
SJ3  73.5,16.3 0 top
T1  86.1,43.3 90 top
T2  71.21,43.83 0 top
U1  18.6,33.9 0 top
U$1  LT1935ES5  [SOT23-5']  16.3,25.5 90 top
U$2  LT1935ES5  [SOT23-5']  27.3,12.3 0 top
XB1  11,50 90 top

### Tracks (layer width: path | path; a pad name or v marks a point on that pad's centre or on a via)
1V8
  Top 0.406: IC_19.3 42.27,61.63 42.8,61.1 R7.1 42.8,59.4 42.5,59.1 40.5,59.1 39.3,57.9 37.1,57.9 36.4,57.2 | C15.2 29.1,69.3 29.1,67.5 28.6,67 R8.1 28.6,60.7 28.93,60.37 IC_19.7 IC_19.8 33.08,58.42 33.6,57.9 35.7,57.9 36.4,57.2 | 36.4,57.2 IC_18.1 36.4,54.5 36.6,54.3 48.3,54.3 48.7,54.7 IC_17.1 48.71,60.39 45.9,63.2 45.9,72.3 R6.1
  Top 0.61: IC_16.8 29.84,71.53 29.4,71.1 28.7,71.1 C15.2 C16.2 25.79,70.39 C9.2 21.3,70.4 20.25,69.35 IC_3.5 19.83,66.88 C19.2
2V8  (via drill 0.33)
  Top 0.406: IC_10.1 85.21,37.79 81.9,41.1 81.9,45.1 80.6,46.4 v73.4,46.4
  Bottom 0.406: v73.4,46.4 71,46.4 70,45.4 IC_9.15
3.3V  (2 unrouted)
3V3  (via drill 0.33)
  Top 0.152: IC_7.1 50.8,41.3 50.9,41.4 51.1,41.4 | 49.7,40 50,39.7 IC_7.8
  Top 0.254: IC_8.1 52.8,41 52.4,41.4 51.1,41.4 50.7,41.8 | C28.2 50.7,41.8 | 48.6,41.4 48.6,40.3 48.9,40 49.7,40 | 48.6,41.4 48.9,41.7 50.6,41.7 50.7,41.8 | 48.6,41.4 47.7,41.4 v46.9,42.2
  Top 0.406: IC_12.AREF 45.2,7.6 42.8,7.6 42,8.4 42,12.6 38.3,16.3 38.3,19 38.6,19.3 R46.1 R45.1 37.4,20.6 v35.4,22.6 | v30,28 28.2,28 25.5,30.7 v25.5,33.8
  Top 0.61: v67.7,24.8 67.7,22.9 v68.8,21.8 | IC_8.1 53.7,45.5 v55.3,47.1 | IC_15.12 69.63,54.13 68.9,53.4 68.9,48.88 C24.2 69.26,47.86 v65,43.6 | C25.2 1.97,39.03 XB1.1
  Top 0.813: 17.65,36.05 17,36.7 v14.4,36.7
  Top 1.016: U1.5 17.65,36.05 18.3,36.7 22.6,36.7 v25.5,33.8
  Bottom 0.254: v46.9,42.2 46.2,42.2 45.9,41.9 R42.1
  Bottom 0.406: 76.6,9.9 IC_13.24 | v35.4,22.6 v30,28
  Bottom 0.61: C27.2 71.81,11.11 R26.2 | R26.2 R27.2 R28.2 72.3,20.7 71.2,21.8 v68.8,21.8 | R26.2 72.3,9.6 72.9,9 75.7,9 76.6,9.9 | v55.3,47.1 55.3,47.6 54.1,48.8 | 61.85,43.15 64.55,43.15 v65,43.6
  Bottom 0.813: v14.4,36.7 2.9,36.7 2,37.6 XB1.1
  Bottom 1.016: v25.5,33.8 25.5,36.6 37.7,48.8 54.1,48.8 56.2,48.8 61.85,43.15 65.4,39.6 65.4,27.1 v67.7,24.8
5V  (via drill 0.33)
  Top 0.254: R5.2 10.3,20.5 10.3,22 | R3.2 2.8,32.1 3.3,32.6 7.4,32.6 10.3,29.7 12,31.4 16,31.4 C5.1
  Top 0.305: 10.3,21.9 10.3,22 10.3,29.7
  Top 0.406: C5.1 R13.1 19.7,30.6 20.8,30.6 21.8,29.6 DOUT.2 | U1.1 17.65,31.65 17.8,31.5 19.25,31.5 19.55,31.2 | IC_10.14 85.21,32.89 84.8,33.3 78.2,33.3 77.6,32.7 IC_10.8 | IC_3.1 20.25,63.75 20.8,63.2 22.1,63.2 22.15,63.25
  Top 0.61: U1.3 19.55,31.2 19.55,30.75 19.7,30.6 | 38.9,50.1 38.9,52 | 38.9,52 38.9,52.2 39.6,52.9 48.1,52.9 48.7,52.3 IC_17.14 | IC_18.8 28.79,52.29 | 28.79,52.29 29.4,52.9 38,52.9 38.9,52 | IC_17.8 40.3,50.8 38.9,49.4 | IC_18.14 37.5,50.7 38.9,49.3 | IC_3.3 22.15,63.25 v22.6,62.8 | v25.2,53 28.08,53 28.79,52.29
  Top 0.813: v85.1,28.8 85.21,28.91 IC_10.14 | v38.9,46.9 38.9,49.3 38.9,49.4 38.9,50.1
  Top 1.016: 21.7,29.1 DOUT.2 22.4,28.4 C6.1 v25.7,28.4
  Bottom 0.61: v22.6,62.8 22.6,55.6 v25.2,53
  Bottom 0.813: 83.3,22.9 83.3,27 v85.1,28.8 | 45.6,45.6 40.2,45.6 v38.9,46.9 | IC_12.VIN 39.11,1.29 38.1,2.3 38.1,7.9 35.2,10.8 35.2,21 27.8,28.4
  Bottom 1.016: v25.7,28.4 27.8,28.4 28.4,28.4 45.6,45.6 57.2,45.6 63.6,39.2 63.6,26.3 67,22.9 83.3,22.9 85.4,20.8 | 85.4,20.8 85.4,2.08 JP1.9 | JP2.1 86.68,22.08 85.4,20.8
12V  (via drill 0.33)
  Top 0.406: C2.1 R15.1 32.4,7.2 32.1,6.9
  Top 0.813: C3.1 30.9,5.3 DOUT1.2 32.1,6.9 36,6.9 v38.6,9.5 | v46.2,44.4 46.9,45.1 51.8,45.1 v56.8,50.1 | v81.8,24.2 85.7,24.2 v89.1,20.8
  Bottom 0.813: v38.6,9.5 38.4,9.5 36.5,11.4 36.5,34.7 v46.2,44.4 | v56.8,50.1 57,50.1 62.5,44.6 65.5,44.6 66.2,43.9 66.2,40.7 66.9,40 66.9,27.5 70.2,24.2 v81.8,24.2 | v89.1,20.8 87.5,20.8 86.8,20.1 86.8,13.6 91.6,8.8 91.6,7.3 92.5,6.4 BUZZER.2
12V_EN  (via drill 0.33)
  Top 0.254: 34.3,16.8 27.5,16.8 26.4,15.7 R1.1
  Top 0.406: v47,25.3 47.1,25.4 50.3,25.4 IC_12.26 55.79,26.69 55.8,26.7 55.9,26.7 57.4,25.2 58.4,25.2 58.7,25.5 63,25.5 65.7,22.8 65.7,22.3 66.2,21.8 66.2,21.1 67.3,20 78.4,20 80,18.4 v80,13.2 | v46.6,17.9 45.4,17.9 45.3,17.8 42.6,17.8 v40.8,16 | v37.8,13.2 37.8,13.3 34.3,16.8
  Bottom 0.406: v47,25.3 47,18.3 v46.6,17.9 | v37.8,13.2 40.6,16 v40.8,16 | IC_13.17 81.05,12.35 81,12.4 80.9,12.5 80.7,12.5 v80,13.2
ANALOG_XAXIS  (via drill 0.33)
  Top 0.406: IC_12.A13 49.06,12.54 53.9,7.7 66.4,7.7 68.5,9.8 71.8,9.8 72.1,9.5 80.5,9.5 85.1,14.1 90.4,14.1 v92,15.73
  Bottom 0.406: JP2.6 95.97,15.73 v92,15.73
ANALOG_YAXIS  (via drill 0.33)
  Top 0.406: IC_12.A12 51.6,15.8 57.2,10.2 65.4,10.2 v66.2,11 | JP2.8 96.03,15.73 93.3,15.73 91,13.4 85.6,13.4 81,8.8 v69.1,8.8
  Bottom 0.406: v66.2,11 66.9,11 v69.1,8.8
BT_CMD  (via drill 0.33)
  Top 0.406: 82.4,58.5 82.4,56.1 v80.8,54.5 | v70.5,25.6 67.1,25.6 66.4,24.9 66.4,22.7 v67.4,21.7 | v64.6,22.8 63.6,21.8 63.6,21.6 61,21.6 59.7,20.3 58.2,20.3 57.6,19.7 v57.1,19.7
  Top 0.61: IC_15.34 82.53,70.63 81.5,69.6 81.5,59.4 82.4,58.5 83.84,58.5 IC_15.26
  Bottom 0.406: IC_12.33 49.09,21.61 50.4,20.3 56.7,20.3 57.1,19.9 v57.1,19.7 | v80.8,54.5 81.6,53.7 81.6,48.1 86.2,43.5 86.2,34.5 76.9,25.2 70.9,25.2 v70.5,25.6 | v67.4,21.7 65.6,21.7 64.6,22.7 v64.6,22.8
BT_EN  (via drill 0.33)
  Top 0.406: IC_12.27 56.93,29.23 58.2,30.5 69.2,30.5 71,32.3 71,34.4 71.6,35 73.5,35 v74,34.5 | v73.6,40.3 73.6,42 v76.9,45.3 | v80.6,47.6 81.9,47.6 83.6,49.3 83.6,49.4 84.2,50 85.7,50 86.9,48.8 86.9,46.6 88,45.5 89.3,45.5 v89.4,45.4 | v90.6,40.9 90.6,42.08 R23.2
  Bottom 0.406: v74,34.5 74,39.9 v73.6,40.3 | v76.9,45.3 78.3,45.3 v80.6,47.6 | v89.4,45.4 89.4,42.1 v90.6,40.9
BT_RX  (via drill 0.33)  (1 unrouted)
  Top 0.406: v58,36.1 58,63.7 63.5,69.2 71.3,69.2 71.5,69 71.1,69 IC_15.2
  Bottom 0.406: 54.8,24.1 57.5,26.8 57.5,32.9 58,33.4 v58,36.1
BT_TX  (via drill 0.33)  (1 unrouted)
  Top 0.406: v61,20.3 65.9,20.3 v66.2,20 | v68,20.8 69.2,20.8 70.3,21.9 76.4,21.9 80.8,26.3 85.9,26.3 86.8,27.2 86.8,33.9 v87,34.1 | v80.6,56.3 80.6,62.7 72.7,70.6 71,70.6 IC_15.1
  Bottom 0.406: 56.8,21.2 57.7,20.3 v61,20.3 | v66.2,20 67.2,20 v68,20.8 | v87,34.1 87,43.7 82.5,48.2 82.5,54.4 v80.6,56.3
BTN_A  (via drill 0.33)
  Top 0.406: JP2.3 90.84,19.54 90.2,18.9 83.2,18.9 v82.7,18.4
  Bottom 0.406: v82.7,18.4 82.3,18 82.3,17.7 82.32,17.68 IC_13.10
BTN_B  (via drill 0.33)
  Top 0.406: v83.7,18.1 93.63,18.1 JP2.5
  Bottom 0.305: IC_13.11 83,16.73 83,17.7 83.4,18.1 v83.7,18.1
  Bottom 0.406: 83.5,18.1 v83.7,18.1
BTN_C  (via drill 0.33)
  Top 0.406: JP2.7 92.97,12.7 87,12.7 v83.6,9.3
  Bottom 0.406: IC_13.13 v83.59,9.31 v83.6,9.3
BTN_D  (via drill 0.33)
  Top 0.406: JP2.9 87.32,11.92 85.3,9.9 85.3,9.3 v83.6,7.6
  Bottom 0.305: 82.8,10.1 83,10.3 83,11.27 IC_13.14
  Bottom 0.406: v83.6,7.6 82.8,8.4 82.8,10.1
BTN_E  (via drill 0.33)
  Top 0.406: JP2.2 95.85,23.5 93.6,23.5 89.7,19.6 82.8,19.6 81.2,18 v81.2,14.3
  Bottom 0.305: 82.3,13.9 82.3,11.33 IC_13.15
  Bottom 0.406: 82.3,13.9 81.9,14.3 v81.2,14.3
BTN_F  (via drill 0.33)
  Top 0.406: v90.8,16.1 89.5,14.8 84.7,14.8 83.1,13.2 v81.2,13.2
  Bottom 0.406: IC_13.16 81.69,12.71 v81.2,13.2 | v90.8,16.1 90.8,17 92.1,18.3 96.03,18.3 JP2.4
BUZZER_ACT  (via drill 0.33)
  Top 0.254: R49.2 87.9,9.6 90,9.6 90.5,9.1 90.5,2.2 89,0.7 63.5,0.7 61.7,2.5 58.3,2.5
  Top 0.406: v50.3,4.1 52.7,4.1 54.3,2.5 58.3,2.5
  Bottom 0.406: IC_12.23/A9 43.98,8.22 45.2,7 45.4,7 49.1,3.3 49.5,3.3 v50.3,4.1
CHG_STAT  (1 unrouted)
  Top 0.254: IC_6.1 2.65,30.24 R3.1
DISPLAY_BL  (1 unrouted)
  Top 0.406: 58.2,5.1 63.2,5.1 65,3.3 JP1.1
DISPLAY_DC  (via drill 0.33)
  Top 0.406: IC_12.4 59.31,13.9 v64.2,13.9
  Bottom 0.406: v64.2,13.9 64.2,12.9 65,12.1 65,10.7 67.8,7.9 76.88,7.9 JP1.8
DISPLAY_SDCS  (via drill 0.33)
  Top 0.406: IC_12.5 59.25,16.5 v63.2,16.5
  Bottom 0.406: v63.2,16.5 63.2,9.9 66.9,6.2 73.5,6.2 JP1.6
GND  (via drill 0.33)
  Top 0.152: IC_7.9 50.4,38.77 49.73,38.1 v49.4,38.1
  Top 0.254: 2.19,28.68 C8.1 | IC_11.2 73.4,31.9 73.7,32.2 74.6,32.2 | v49.4,38.1 49.4,38.9 IC_7.6 IC_7.7
  Top 0.406: IC_6.2 2.19,28.68 | U1.2 18.6,33.2 18.1,33.7 | 18.1,33.7 16.11,33.7 v15.91,33.5 | 74.6,32.2 74.9,32.5 74.9,35.69 C21.1 | SJ2.1 SJ3.1 | v70.6,14 SJ2.1 | v73.3,10.3 72.99,10.41 SJ1.1 SJ2.1 | C28.1 52.5,43.8 52.3,44 47.3,44 45.6,42.3 45.6,39.2 46.7,38.1 v49.4,38.1 | IC_8.4 55.8,41 55.8,41.8 v55.1,42.5 | C24.1 71.55,47.25 72.3,46.5 72.3,42.88 T2.2 | 21.2,65.9 19.17,65.9 C19.1 18.33,65.1 15.2,65.1 14,63.9 XB1.14 | 21.2,65.9 IC_3.2 | 21.2,65.9 23.2,65.9 C10.1 24.9,65.1 25.8,66 C16.1 | v27.6,67.4 28,67.8 C15.1 C16.1 | C9.1 23.6,68.6 C16.1 | IC_17.7 v38.7,56 | v28.8,58.3 IC_18.7 | R47.1 88.2,10.5 v87.6,11.1 | IC_19.4 v40.8,62.91 v40.8,62.9 | IC_16.28 IC_16.27 42.47,78.14 v42.8,77.8 | IC_16.25 IC_16.24 40.44,74.83 v41.7,76.1 | IC_16.2 29.73,78.14 29.6,78 | C11.1 21,33.7 18.1,33.7 | IC_1.3 IC_1.2
  Top 0.61: R22.1 92.74,47.86 92.2,48.4 90.77,48.4 Q1.2 90.76,49.56 v91,49.8 | v84.8,49.2 85.2,48.8 85.2,45.9 86.85,44.25 T1.2 88.95,44.25 R10.2 | v94.7,38 93.42,36.72 C20.1 | T2.2 72.12,42.69 R12.2 72.2,40.58 v72.2,39.4 74.53,37.07 C21.1 77.05,36.06 IC_10.7 | v84.1,4.7 84.8,4 v89.4,4 Q3.2 | IC_19.4 37,62.9 36.25,63.65 IC_16.15 36.25,67.65 36.9,68.3 v38.2,68.3 | IC_16.19 41.27,69.33 41.6,69 41.6,67.8 v43.1,66.3 | v45,68.1 45,68.9 C17.1 C18.1 | IC_16.3 29.73,77.03 v29.6,76.9 | IC_16.1 30.14,79.23 29.6,78.7 29.6,78 v29.6,76.9 | v29.6,76.9 v28.2,76.9 v26.8,76.9 26.62,77.08 J1.P$1 21.18,77.08 20.2,76.1 20.2,75.2 21.1,74.3 23.57,74.3 J1.P$2 24.57,74.33 v25.6,73.3 26.2,73.9 L1.1 L2.1 | IC_16.7 33.03,72.64 33.2,72.8 v33.2,74.3 32.9,74.6 32.5,74.6 32.27,74.83 IC_16.5 | v33.3,68.3 33.3,70 32.87,70.44 IC_16.9 29.93,70.44 v29.6,70.1 | C25.1 1.97,43.37 v2.8,44.2 | v26.4,2.6 C3.2 28.8,4.8 29.5,5.5 29.5,8 28.9,8.6 | v27.3,12.3 U$2.2 27.3,9.1 27.8,8.6 28.9,8.6 | C1.2 R21.2 33.4,13.7 v33.6,13.5 | v28.9,9.7 28.9,8.6 | U$1.2 v16.3,25.5 | C6.2 25.4,26.6 v25.8,26.2 26.2,25.8 26.2,19.1 24.9,17.8 18.1,17.8 17.3,18.6 CIN.2 | R14.2 C4.2 12.4,30.6 v11.5,29.7 | C7.1 7.63,24.9 | 7.63,24.9 7.63,22.93 6.9,22.2 JP3.1 | IC_6.2 4.22,28.68 | 4.22,28.68 4.6,28.3 4.6,27.1 5.1,26.6 5.93,26.6 7.63,24.9 | R4.1 4.02,30.88 4.6,30.3 4.6,29.06 4.22,28.68 | IC_1.2 2.8,20.2 v2.2,20.8 | v8.6,33.3 3,33.3 v2.8,33.1
  Top 0.813: J$1.GND@2 v97.5,52.6 | v97.5,62 J$1.GND@1 | v41,2.5 41,0.8 v38,0.8 | JP6.GND 16.8,8.8 CIN1.2 20.3,10.2 v19.7,9.6
  Bottom 0.254: 63.5,0.7 86.56,0.7 | v49.4,38.1 51.51,38.1 51.91,37.7
  Bottom 0.406: C27.1 69.61,13.01 v70.6,14 | v84.1,4.7 84.4,5 84.4,14.2 arc90 84.3,14.3 83.7,14.9 83.7,15.1 | 83.7,15.1 83.7,16.58 IC_13.12 | v73.3,10.3 75.3,10.2 75.9,10.8 75.9,13.2 77.9,15.2 83.6,15.2 83.7,15.1 | 50.3,14.8 50.3,17.77 | 50.3,17.77 IC_12.GND2 | S1.3 51.91,41.1 | 51.91,41.1 51.91,37.7 S1.4 51.91,34.62 IC_12.GND1 50.29,33 48.4,33 47,31.6 47,26.7 48.1,25.6 48.1,25 47.8,24.7 47.8,18.1 48.1,17.8 50.27,17.8 50.3,17.77 | v55.1,42.5 53.3,42.5 51.91,41.1 | v27.6,67.4 28.5,68.3 v33.3,68.3 | v28.8,58.3 28.8,56.8 29.6,56 v38.7,56 43.2,56 44.8,57.6 44.8,59.3 44.1,60 39.3,60 39,60.3 39,63.1 39.9,64 | v43.1,66.3 43,66.2 42.1,66.2 39.9,64 | 62.91,1.29 63.5,0.7 | 86.56,0.7 JP1.10 | v87.6,11.1 89.4,9.3 v89.4,4 | v94.7,38 95.2,38.5 99.1,38.5 | v40.8,62.9 40.8,63.1 39.9,64 | v42.8,77.8 42.8,78.8 43.1,79.1 | v41.7,76.1 40.3,76.1 40.1,75.9 | 31.45,78.06 31.13,78.06 30.1,77.03 29.73,77.03 v29.6,76.9
  Bottom 0.61: 88.9,49.5 IC_9.65 85.1,49.5 v84.8,49.2 | IC_9.61 89.4,53.5 | IC_9.59 IC_9.58 | IC_9.58 89.3,56.5 | 87.35,60.6 IC_9.54 IC_9.53 | IC_9.58 84.9,56.5 83.9,57.5 IC_9.29 63,57.5 62.4,56.9 62.4,47.1 63,46.5 IC_9.18 66.3,46.5 68,44.8 IC_9.17 68,41.8 68.7,41.1 70.5,41.1 v72.2,39.4 | IC_9.46 78.95,65.75 78.9,65.8 78.9,68.7 | 78.9,68.7 78.9,70.1 78.7,70.3 | IC_9.45 78,67.8 78.9,68.7 | IC_9.39 72,70.1 72.2,70.3 | v91,49.8 90.2,49.8 89.7,50.3 | 96.19,36.1 SIMCONN.6 94.7,37.26 v94.7,38 | JP1.10 87.86,2.46 v89.4,4 | BAT1.GND 32.72,5.6 | 32.72,5.6 32.72,1.62 31.9,0.8 | IC_12.GND | 50,0.9 51.01,2.31 R44.1 52.17,6.77 52.8,7.4 52.8,12.3 50.3,14.8 | v43.1,66.3 43.2,66.3 v45,68.1 | 32.4,73.4 32.4,73.5 v33.2,74.3 | v38.3,74.3 38.3,73.4 38.2,73.3 v38.2,68.3 v33.3,68.3 | 0.8,37.9 0.8,40 | 0.8,60 0.8,62.1 | v2.8,44.2 1.9,44.2 0.8,43.1 | v26.4,2.6 29.72,2.6 32.72,5.6 | v33.6,13.5 32.7,13.5 v28.9,9.7 | v25.8,26.2 25.1,25.5 v16.3,25.5 15.91,25.89 15.91,28.4 | XB1.10 17.8,41.2 1.4,41.2 0.8,40.6 | v15.91,33.5 15.91,28.4 | 15.91,28.4 14.61,29.7 v11.5,29.7 9.6,29.7 8.1,31.2 8.1,32.8 v8.6,33.3 | 0.8,20.8 v2.2,20.8 3.6,22.2 JP3.1 | 0.8,29.2 2.8,31.2 v2.8,33.1
  Bottom 0.813: JP1.10 94.6,2 97.3,4.7 97.3,11.89 JP2.10 99.1,13.75 99.1,38.5 99.1,52.6 97.5,54.2 J$1.GND@2 | 62.91,1.29 IC_12.GND 58.83,0.9 50,0.9 46.6,0.9 43.98,3.52 IC_12.AGND 42.93,3.83 v41,2.5 | 31.45,74.35 32.4,73.4 38.3,73.4 39,73.4 40.1,74.5 40.1,75.9 40.1,78 40.2,78 41.3,79.1 43.1,79.1 68.7,79.1 69.5,78.3 69.5,71.6 70.8,70.3 72.2,70.3 78.7,70.3 84.4,70.3 85.7,71.6 85.7,77.7 87.1,79.1 93.3,79.1 99.1,73.3 99.1,61.68 J$1.GND@1 | 31.45,74.35 31.4,74.4 | J$1.GND@2 94.65,55 C23.1 | C22.1 97.47,60.05 J$1.GND@1 | J$1.GND@2 v97.5,52.6 97.4,52.7 90.2,52.7 | J$1.GND@1 v97.5,62 97.4,62.1 91,62.1 90.1,61.2 90.1,60.6 | J$1.GND@1 97.68,60.08 | 88.9,49.5 89.7,50.3 89.7,50.4 | 89.7,50.4 89.7,51.5 | 89.7,51.5 89.7,52.2 | 89.7,52.2 90.2,52.7 | IC_9.64 89.6,50.5 89.7,50.4 | IC_9.63 89.7,51.5 | IC_9.62 89.4,52.5 89.7,52.2 | 89.4,53.5 90.2,52.7 | 89.3,56.5 90.1,57.3 90.1,60.6 | 90.1,60.6 87.35,60.6 | v38,0.8 31.9,0.8 6.7,0.8 0.8,6.7 0.8,20.8 0.8,29.2 0.8,37.9 | 31.45,74.35 31.45,78.06 30.41,79.1 6.4,79.1 0.8,73.5 0.8,62.1 | 0.8,40 0.8,40.6 0.8,43.1 0.8,60 | v19.7,9.6 24.6,9.6 v27.3,12.3
  pour Top (no thermals): 18.1,25.4 18.4,25.1 18.6,25.1 18.6,25.9 18.4,25.9 18.1,25.6 17.2,25.6 16.8,25.9 16.7,25.9 16.7,25.1 17.2,25.4
  pour Bottom (rank 2): 0.1,80 100.1,80 100.1,-0.1 0.1,-0.1
  pour Top (rank 2): 0,80 100,80 100,0 0,0
GPS_ONOFF  (via drill 0.33)
  Top 0.406: IC_12.14/A0 38.43,31.77 v38.4,31.8 | v42.7,39.4 42.7,44.9 44.8,47 44.8,50.7 IC_17.11
  Bottom 0.406: v38.4,31.8 40.1,33.5 40.1,34.7 42.7,37.3 v42.7,39.4
GPS_ONOFF_1V8  (via drill 0.33)
  Top 0.406: IC_17.4 44.9,58.1 v43.9,59.1 | v42.7,75.6 42.7,76.3 42,77 40.05,77 IC_16.26
  Bottom 0.406: v43.9,59.1 39.2,59.1 38.3,60 38.3,63.3 41,66 41,73.9 v42.7,75.6
GPS_RST
  Top 0.406: IC_12.17/A3 37.65,24.15 33.5,28.3 33.5,30.2 30,33.7 30,47.3 31.4,48.7 31.4,50.63 IC_18.10
GPS_RST_1V8  (via drill 0.33)
  Top 0.406: IC_18.5 31.3,55.93 v31.3,58.1 | v29.8,66.9 29.8,68.9 30.2,69.3 31.34,69.3 IC_16.10
  Bottom 0.406: v31.3,58.1 33.9,60.7 33.9,63.5 30.5,66.9 v29.8,66.9
GPS_RX  (via drill 0.33)
  Top 0.406: v47.9,30.5 v40,30.5 | v44.4,39.8 44.4,44.2 47.44,47.24 IC_17.13 | v56.6,27.5 56.6,27.3 v57.9,26
  Bottom 0.406: v47.9,30.5 52.7,30.5 55.8,27.4 56.5,27.4 v56.6,27.5 | v40,30.5 41.7,32.2 41.7,34.1 44.4,36.8 v44.4,39.8 | IC_12.8 58.35,24.15 57.9,24.6 v57.9,26
GPS_RX_1V8
  Top 0.406: 40.05,71.5 C18.2 43.6,70.6 43.6,68.3 45.2,66.7 45.2,63 47.44,60.76 IC_17.2
  Top 0.61: IC_16.21 40.05,71.5
GPS_SPI_CLK
  Top 0.406: R8.2 33.05,61.6 IC_19.6 34.73,61.63 35.2,62.1 35.2,66.39 IC_16.14
GPS_SPI_CS  (via drill 0.33)
  Top 0.406: IC_19.1 37.01,59.09 v36.6,59.5 | v37.4,64.7 37.4,66.39 IC_16.16
  Bottom 0.406: v36.6,59.5 36.6,63.9 v37.4,64.7
GPS_SPI_MISO  (via drill 0.33)
  Top 0.406: R7.2 40.94,60.37 IC_19.2 35.13,60.37 v34.9,60.6 | v34.1,64.7 34.1,66.39 IC_16.13
  Bottom 0.406: v34.9,60.6 34.9,63.9 v34.1,64.7
GPS_SPI_MOSI
  Top 0.406: IC_19.5 33.08,66.3 IC_16.12
GPS_TM  (via drill 0.33)
  Top 0.406: IC_12.15/A1 38.07,29.23 v37.7,29.6 | v41.8,38.4 41.8,39.9 41.9,40 41.9,45.4 43.63,47.13 IC_17.10
  Bottom 0.406: v37.7,29.6 37.7,31.3 37.6,31.4 37.6,32.2 39.3,33.9 39.3,35.1 41.8,37.6 v41.8,38.4
GPS_TM_1V8  (via drill 0.33)
  Top 0.406: IC_16.11 31.38,64.42 v31.8,64 | v43.6,58 43.6,56.03 IC_17.5
  Bottom 0.406: v43.6,58 43.3,57.7 34.2,57.7 33.3,56.8 31.1,56.8 30.4,57.5 30.4,58.4 33.2,61.2 33.2,62.6 v31.8,64
GPS_TX  (via drill 0.33)
  Top 0.406: v56.6,24.6 v55.3,25.9 | v47.9,28 v40,28 | v43.5,40.3 43.5,44.5 46.2,47.2 46.2,50.77 IC_17.12
  Bottom 0.406: IC_12.7 57.39,21.61 56.2,22.8 56.2,24.2 v56.6,24.6 | v55.3,25.9 53.2,28 v47.9,28 | v40,28 39,29 39,30.9 40.9,32.8 40.9,34.4 43.5,37 v43.5,40.3
GPS_TX_1V8
  Top 0.406: IC_16.20 41.66,70.44 C17.2 42.7,68.3 44.5,66.5 44.5,62.8 46.17,61.13 IC_17.3
GPS_WU
  Top 0.406: IC_12.16/A2 36.11,26.69 34.2,28.6 34.2,30.6 30.8,34 30.8,46.9 32.1,48.2 32.25,48.35 32.6,48.7 IC_18.11
GPS_WU_1V8  (via drill 0.33)
  Top 0.406: IC_18.4 v32.6,57.6 | v40,67 40.02,67.02 IC_16.18
  Bottom 0.406: v32.6,57.6 33.4,58.4 36.6,58.4 37.6,59.4 37.6,63.5 40,65.9 v40,67
IO_INT0  (via drill 0.33)
  Top 0.406: v53.4,25.4 54.5,25.4 56.9,23 62,23 v62.4,22.6 | v75.6,16.5 75.6,16.9 74.7,17.8 67.2,17.8 v64.5,15.1
  Bottom 0.406: IC_12.32 50.3,25.4 v53.4,25.4 | IC_13.1 75.79,16.69 v75.6,16.5 | v64.5,15.1 64.5,20.7 62.6,22.6 v62.4,22.6
N$1
  Top 0.406: 26,10.6 26,10.64 U$2.1
  Top 0.813: 26,10.6 25.45,10.05 L3.2 28,7 DOUT1.1
N$2
  Top 0.406: 18.6,23.6 17.65,24.55 U$1.1
  Top 1.016: 18.6,23.6 21.55,23.6 L6.2 21.6,24.4 21.8,24.6 DOUT.1
  pour Top (no thermals): 18.9,24.1 18.1,24.7 17.1,24.7 17.1,23.9 17.9,23.2 18.9,23.2
N$3
  Top 0.406: U$2.4 28.25,15.55 R1.2 C1.1
N$4
  Top 0.61: U1.4 21.3,35.2 C11.2
N$5
  Top 0.406: U$2.3 29.31,10.99 R15.2 C2.2 R21.1
N$6
  Top 0.406: U$1.3 17.61,27.51 R13.2 C5.2 R14.1
N$8
  Top 0.406: C4.1 R2.2 13.05,26.45 U$1.4
N$11
  Top 0.254: IC_6.5 5.82,29.82
  Top 0.406: 5.82,29.82 R4.2
N$12
  Top 0.254: IC_1.5 2.8,16.85 3.08,17.13 4.95,17.13 Q9.1
N$13
  Top 0.61: IC_3.4 23.6,67.3 C10.2
N$15
  Top 0.61: IC_16.6 28.86,73.73 C14.1 L2.2
N$18
  Top 0.61: IC_16.4 28.93,75.94 C14.2 L1.2 J1.P$3
N$19
  Top 0.406: BUZZER.1 92.3,8.4 91.6,7.7 Q3.3
N$20
  Top 0.406: 40.05,73.7 R6.2
  Top 0.61: IC_16.23 40.05,73.7
N$21
  Top 0.61: R9.2 87.2,40.74 T1.1 87.25,42.4 R10.1
N$22
  Top 0.61: R12.1 70.26,40.72 T2.1 68.65,42.73 R11.2
N$25
  Top 0.406: IC_15.13 IC_15.22 82.72,51.38 IC_15.21
  Top 0.61: IC_15.21 86.62,50.88 88.6,48.9 88.6,47.48 Q1.3
N$27  (via drill 0.33)
  Top 0.406: v94.1,29.8 94.1,30.49 R18.1 91.31,31.21 v91.3,31.2 | v78.9,25.7 74.2,25.7 v73.9,26 | v74.8,30.4 74.8,30.52 IC_11.3
  Bottom 0.406: SIMCONN.4 95.43,31.13 v94.1,29.8 | v91.3,31.2 84.4,31.2 v78.9,25.7 | v73.9,26 73.9,29.5 v74.8,30.4
N$28
  Bottom 0.61: R20.2 R19.1
  Bottom 0.813: R19.1 C22.2
N$29  (via drill 0.33)
  Top 0.406: v70,34.8 68.81,34.8 R16.2 | IC_11.6 72.74,33.66 72.4,34 v72.4,34.2
  Bottom 0.406: v70,34.8 70.71,34.09 SIMCONN.2 71.41,34.2 v72.4,34.2
N$30  (via drill 0.33)
  Top 0.305: 73.4,32.7 IC_11.5 73.4,32.6 73.1,32.3 v72,32.3
  Top 0.406: v68.2,32.7 67.5,32.7 R17.2
  Bottom 0.406: v72,32.3 SIMCONN.3 69.11,32.7 v68.2,32.7
N$31
  Bottom 0.813: R19.2 J$1.SIG
N$34
  Top 0.61: R22.2 92.17,44.21 R23.1 90.76,44.39 Q1.1
N$35
  Top 0.254: 89.35,7.4 Q3.1
  Top 0.406: R49.1 89.35,7.4 | R47.2 Q3.1
N$37  (via drill 0.33)
  Top 0.406: SJ1.2 v75.1,11.7 76.6,10.2 78.4,10.2 79,10.8 v79,14.1
  Bottom 0.406: v75.1,11.7 74.2,11.7 R26.1 | IC_13.21 78.51,12.31 79,12.8 v79,14.1
N$38  (via drill 0.33)
  Top 0.406: SJ3.2 74.91,15.4 v75.2,15.4
  Bottom 0.406: IC_13.3 77.88,17.82 77.6,18.1 75.9,18.1 R28.1 75,15.4 v75.2,15.4
N$39  (via drill 0.33)
  Top 0.406: SJ2.2 v75.1,14
  Bottom 0.406: R27.1 v75.1,14 76.1,15 76.6,15 77.24,15.64 IC_13.2
N$43  (via drill 0.33)
  Top 0.406: IC_12.VBAT 56.68,35.32 56,36 37.8,36 | 32.8,21.9 v32.8,26.7
  Top 0.61: v25,14.8 25,16.6 26.1,17.7 v33.2,17.7 | v33.6,21.1 32.8,21.9 | v35.3,33.5 37.8,36
  Bottom 0.406: BAT1.PWR@1 24.85,7.11 | v32.8,26.7 32.8,31 v35.3,33.5
  Bottom 0.61: 24.85,7.11 24.06,7.9 20.1,7.9 18.7,9.3 18.7,10.4 23.1,14.8 v25,14.8 | v33.2,17.7 33.6,18.1 v33.6,21.1
N$44
  Bottom 0.406: IC_12.A10 46.66,11.45 R43.1 R44.2
NRESET  (via drill 0.33)
  Top 0.61: v69.1,46.1 70.27,44.94 T2.3
  Bottom 0.61: IC_9.16 69,46 v69.1,46.1
PWR_STAT  (1 unrouted)
  Top 0.254: IC_1.4 1.85,17.02 2.45,17.62 5.45,17.62 5.65,17.42 9.02,17.42 R5.1
PWRKEY  (via drill 0.33)
  Top 0.61: T1.3 85.2,43.1 v85.2,42.2
  Bottom 0.61: v85.2,42.2 84.15,43.25 IC_9.1
RESET
  Bottom 0.406: S1.1 48.09,38.4 | 48.09,38.4 S1.2 46.52,35.63 IC_12.RESET | R42.2 47.2,39.3 48.09,38.4
RF_ANT
  Bottom 0.61: IC_9.60 89.59,54.5 R20.1 90.84,54.5 92.25,54.5 C23.2
SCL  (via drill 0.33)
  Top 0.152: IC_8.3 55.7,39.2 | 50.4,40.4 IC_7.2
  Top 0.254: 55.7,39.2 54.9,40 50.8,40 50.4,40.4
  Top 0.406: R46.2 39.5,17.6 40.9,19 43.91,19 IC_12.19/A5 46.1,19.07 | 46.1,19.07 46.87,19.07 48.1,20.3 53,20.3 58,15.3 63.4,15.3 66.6,18.5 75.2,18.5 76.4,17.3 76.4,13.6 77.2,12.8 v77.9,12.8 | v46.1,20.3 46.1,19.07 | v50.8,37 53.7,37 IC_8.3
  Bottom 0.406: v46.1,20.3 46.1,32 47.8,33.7 47.8,35.1 48.6,35.9 49.2,35.9 50.3,37 v50.8,37 | IC_13.22 77.88,12.78 v77.9,12.8
SDA  (via drill 0.33)
  Top 0.152: 51.3,39.1 IC_7.10
  Top 0.254: 53.1,39 51.4,39 51.3,39.1
  Top 0.406: R45.2 40.3,22.4 41.2,21.5 43.87,21.5 IC_12.18/A4 45.4,21.61 | 45.4,21.61 46.91,21.61 48.1,22.8 53.3,22.8 55.7,20.4 55.7,19 56.9,17.8 64.6,17.8 66,19.2 75.7,19.2 77.9,17 v77.9,14.1 | IC_8.2 53.1,39 53.1,38.4 52.9,38.2 50.7,38.2 49.6,37.1 45.6,37.1 v45.3,36.8 | 45.4,21.61 45.3,21.71 v45.3,22.8
  Bottom 0.406: v45.3,36.8 v45.3,22.8 | v77.9,14.1 77.1,13.3 77.1,12.4 77.24,12.26 IC_13.23
SIM900_PWR  (via drill 0.33)
  Top 0.406: IC_12.2 62.09,8.91 | 62.09,8.91 62.1,8.9 | 62.09,8.91 65.81,8.91 67.4,10.5 68.2,10.5 69.6,11.9 69.6,15 v71,16.4 | v70.7,20.8 76.6,20.8 81.2,25.4 86.2,25.4 87.9,27.1 87.9,38.09 R9.1
  Bottom 0.406: v71,16.4 71,20.5 v70.7,20.8
SIM900_RESET  (via drill 0.33)  (1 unrouted)
  Top 0.406: v65.4,13.2 64.9,12.7 57.6,12.7 52.6,17.7 | v62,38.4 66.12,38.4 R11.1
  Bottom 0.406: v65.4,13.2 65.4,20.8 62.3,23.9 62.3,38.1 v62,38.4
SIM900_RI  (via drill 0.33)
  Top 0.406: IC_12.30 49.06,29.26 50.3,30.5 55.9,30.5 58.4,33 62.4,33 63.9,31.5 v68,31.5 | IC_10.10 80.13,29.93 79.7,29.5 v69.6,29.5
  Bottom 0.406: v69.6,29.5 69.4,29.5 68.2,30.7 68.2,31.3 v68,31.5
SIM900_RI_2V8  (via drill 0.33)
  Top 0.61: IC_10.5 80.13,38.77 v80.1,38.8
  Bottom 0.61: v80.1,38.8 81,39.7 IC_9.4
SIM900_RX  (via drill 0.33)
  Top 0.406: IC_12.10 61.67,29.23 61.7,29.2 67.8,29.2 v68.1,29.5 | IC_10.13 83.94,29.04 82,27.1 v69.9,27.1
  Bottom 0.406: v69.9,27.1 69.9,27.7 v68.1,29.5
SIM900_RX_2V8  (via drill 0.33)
  Top 0.406: IC_10.2 83.94,37.86 80.7,41.1 75.3,41.1 v75,40.8
  Bottom 0.406: v75,40.8 IC_9.10
SIM900_STATUS
  Top 0.406: IC_12.31 49.39,26.69 50.7,28 54.5,28 55,28.5 57.7,28.5 58.2,28 67.9,28 68.6,28.7 80.5,28.7 81.4,29.6 IC_10.11
SIM900_STATUS_2V8  (via drill 0.33)
  Top 0.406: v83.8,48 83,47.2 83,41.2 86.7,37.5 86.7,35.3 86.2,34.8 81.9,34.8 81.4,35.3 IC_10.4
  Bottom 0.406: v83.8,48 85.2,48 85.7,48.5 IC_9.66
SIM900_TX
  Top 0.406: IC_12.9 61.69,26.69 | 61.69,26.69 61.7,26.7 | 61.69,26.69 67.89,26.69 69.1,27.9 81.3,27.9 82.7,29.3 82.7,31.37 IC_10.12
SIM900_TX_2V8  (via drill 0.33)
  Top 0.406: v76.3,40 80.3,40
  Top 0.61: 80.3,40 82.6,37.7 82.6,36.67 IC_10.3
  Bottom 0.406: IC_9.9 76,40.3 v76.3,40
SIM_CLK  (via drill 0.33)
  Top 0.406: R17.1 59.59,36.1 58.8,36.9 58.8,58.7 v60.6,60.5
  Bottom 0.406: v60.6,60.5 IC_9.32
SIM_DATA  (via drill 0.33)
  Top 0.406: R18.2 93.37,34.2 C20.2 91.96,34.24 91.1,35.1 91.1,36.9 95.3,41.1 95.3,48.3 92.2,51.4 88.5,51.4 87.2,52.7 87.2,67.3 v86.2,68.3 | v80.1,68.3 76.5,68.3 v75.9,68.9 | v73.3,68.1 v73.3,59.5
  Bottom 0.406: v86.2,68.3 v80.1,68.3 | v75.9,68.9 74.1,68.9 v73.3,68.1 | v73.3,59.5 IC_9.31
SIM_RST  (via drill 0.33)
  Top 0.406: R16.1 68.36,36.74 68.1,37 64.4,37 64.2,36.8 60.1,36.8 59.6,37.3 59.6,58 61.5,59.9 61.5,60.9 v62.1,61.5
  Bottom 0.406: v62.1,61.5 IC_9.33
SIM_VDD  (via drill 0.33)
  Top 0.406: C21.2 72.73,36.97 v72.1,37.6 71.3,38.4 67.5,38.4 66.8,37.7 63.7,37.7 63.5,37.5 61.1,37.5 60.5,38.1 60.5,57.3 v61.7,58.5 | IC_11.1 72.74,30.64 v72.4,30.3
  Bottom 0.406: SIMCONN.1 70.7,36.16 70.7,37.2 71.1,37.6 v72.1,37.6 73.2,36.5 73.2,33.9 73.1,33.8 73.1,31 v72.4,30.3 | v61.7,58.5 IC_9.30
SPI1_CS  (via drill 0.33)
  Top 0.406: v63.4,19.1 59.25,19.1 IC_12.6
  Bottom 0.406: JP1.5 71.76,5.4 66.5,5.4 62.3,9.6 62.3,18 v63.4,19.1
SPI1_MISO
  Bottom 0.406: IC_12.11 59.83,31.77 60.7,30.9 60.7,22.1 61.8,21 61.8,19.7 60.7,18.6 60.7,8.8 65.8,3.7 68.38,3.7 JP1.3
SPI1_MOSI
  Bottom 0.406: IC_12.12 60.79,34.31 61.5,33.6 61.5,22.4 62.5,21.4 62.5,19.3 61.5,18.3 61.5,9.2 66.1,4.6 70.02,4.6 JP1.4
SPI1_RST  (via drill 0.33)
  Top 0.406: IC_12.3 59.27,11.5 v64.1,11.5
  Bottom 0.406: v64.1,11.5 64.1,10.4 67.4,7.1 75.14,7.1 JP1.7
SPI1_SCK  (via drill 0.33)
  Top 0.406: v51.7,11.5 53.4,11.5 v56,8.9 | v61.1,6.4 62.3,6.4 63.14,6.4 JP1.2
  Bottom 0.406: v51.7,11.5 45.4,17.8 43,17.8 42.4,18.4 42.4,33.2 43.32,34.12 43.32,34.22 43.98,34.22 IC_12.13 | v56,8.9 56,8.4 56.7,7.7 59.8,7.7 v61.1,6.4
VBATT  (via drill 0.33)
  Top 0.254: IC_1.1 3.95,18.5 Q9.3
  Top 0.406: C8.2 2.77,27.24 IC_6.3 | v37.6,11.8 37.6,12.1 v33.9,15.8 | v11.1,18.8 6.9,18.8 Q9.3
  Top 0.508: JP3.2 3.27,26.97 IC_6.3
  Top 1.27: 6.72,18.51 Q9.3 3.77,21.46 3.77,23.07 4.89,24.19 JP3.2
  Bottom 0.406: R43.2 47.2,12.7 45.8,12.7 45.2,12.1 45.2,10.7 44.7,10.2 39.2,10.2 v37.6,11.8 | v33.9,15.8 14.1,15.8 v11.1,18.8
  Bottom 0.61: IC_9.56 84.6,58.5 | IC_9.55 85.3,59.5 | IC_9.57 85.6,57.5
  Bottom 0.813: 85.3,59.5 84.45,58.65 | 85.6,57.5 84.6,58.5
  Bottom 1.27: JP3.2 6,32.7 8.2,34.9 18.9,34.9 22.9,38.9 22.9,48.2 28.5,53.8 44.4,53.8 47.6,57 47.6,62.1 51.5,66 64.6,66 67.6,63 80.1,63 84.45,58.65 84.6,58.5
VEXT  (via drill 0.33)
  Top 0.406: IC_6.4 7.04,28.77 C7.2
  Top 0.61: v7.6,30 7.63,29.97 C7.2
  Top 1.016: JP6.VBUS 13.3,11.33 D4.2
  Bottom 0.61: v7.6,30 7.8,30 9.9,27.9 9.9,14 12.75,11.15 JP6.VBUS
VIN
  Top 0.406: R2.1 12.95,24.55 U$1.5 14.99,23.11 CIN.1 | CIN1.1 25.04,12.3 U$2.5 | IC_1.6 3.75,15.55 4.5,14.8 6.78,14.8 7.97,15.99
  Top 0.813: L3.1 21.35,10.15 CIN1.1
  Top 1.016: L6.1 18.55,19.55 CIN.1 14,21.8 12.6,20.4 12.6,18.34 10.8,16.54 | 10.7,16.54 10.8,16.54 | 10.8,16.54 21.36,16.54 23.5,14.4 CIN1.1 | D4.1 10.18,14.38 10.18,16.02
  Top 1.27: Q9.2 7.97,15.99 8.05,15.93 10.09,15.93 10.18,16.02 10.7,16.54
XBEE_RESET  (via drill 0.33)
  Top 0.406: IC_12.28 51.6,32.2 50.7,33.1 36.4,33.1 35.2,31.9 34.1,31.9 v31.7,34.3 | v27.1,35.2 21.8,40.5 11,40.5 10,39.5 XB1.5
  Bottom 0.406: v31.7,34.3 28,34.3 v27.1,35.2
XBEE_RX  (via drill 0.33)
  Top 0.406: XB1.3 6,41.3 7.3,42.6 21.3,42.6 28.4,35.5 28.4,33.3 31.9,29.8 31.9,21.5 40.2,13.2 40.2,6.4 41.5,5.1 47.3,5.1 49.1,3.3 v52,3.3
  Bottom 0.406: 59.22,6.12 IC_12.1 58.77,6.37 55.7,3.3 v52,3.3
XBEE_SLEEP  (via drill 0.33)
  Top 0.406: v37.5,17.2 34.8,19.9 34.8,21.4 33.8,22.4 33.8,27 32.8,28 32.8,29.9 29.2,33.5 29.2,36 16,49.2 XB1.13
  Bottom 0.406: IC_12.22/A8 42.63,12.8 42.3,12.8 42,13.1 42,16.1 41.3,16.8 40.4,16.8 39.7,16.1 38.5,16.1 37.5,17.1 v37.5,17.2
XBEE_TX  (via drill 0.33)
  Top 0.406: v53.2,2.5 45.2,2.5 45.1,2.6 43,2.6 41.7,3.9 41,3.9 39.5,5.4 39.5,12.8 31.2,21.1 31.2,29.5 23,37.7 5.3,37.7 XB1.2
  Bottom 0.406: IC_12.0 57.89,2.5 v53.2,2.5

### Text on the board
tNames: Red de Acción Comunitaria / reaccion.net / CODENAME Torogoz / BATCH 0002 | 09/11/2015 / Designed in El Salvador | IC_16 | IC_11 | L4 | USER_INTERFACE | DISPLAY_SDCARD_CONN
bNames: USER_GPIO | SIMCARD_CONN